# EAGLE design py32f030f18p6-led (EAGLE 9.6.1)

## Sheet 1 of 2
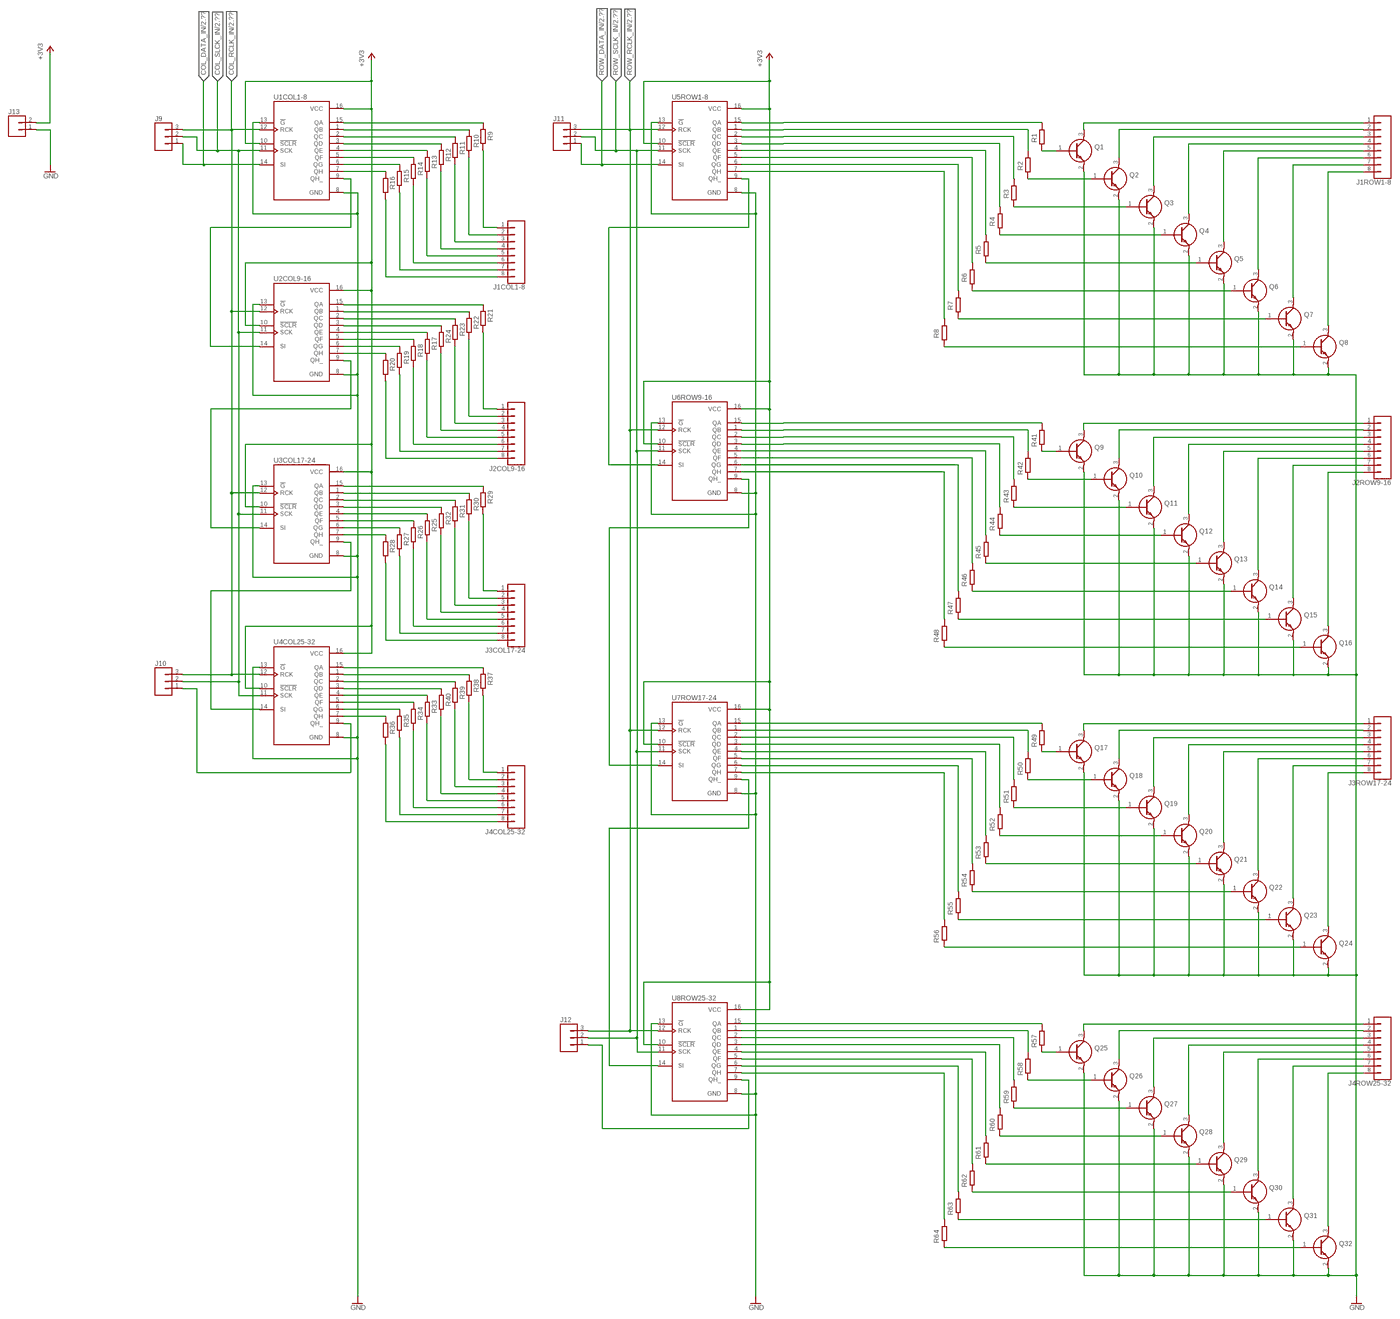
[diagram p0: schematic, sheet 1, overview]
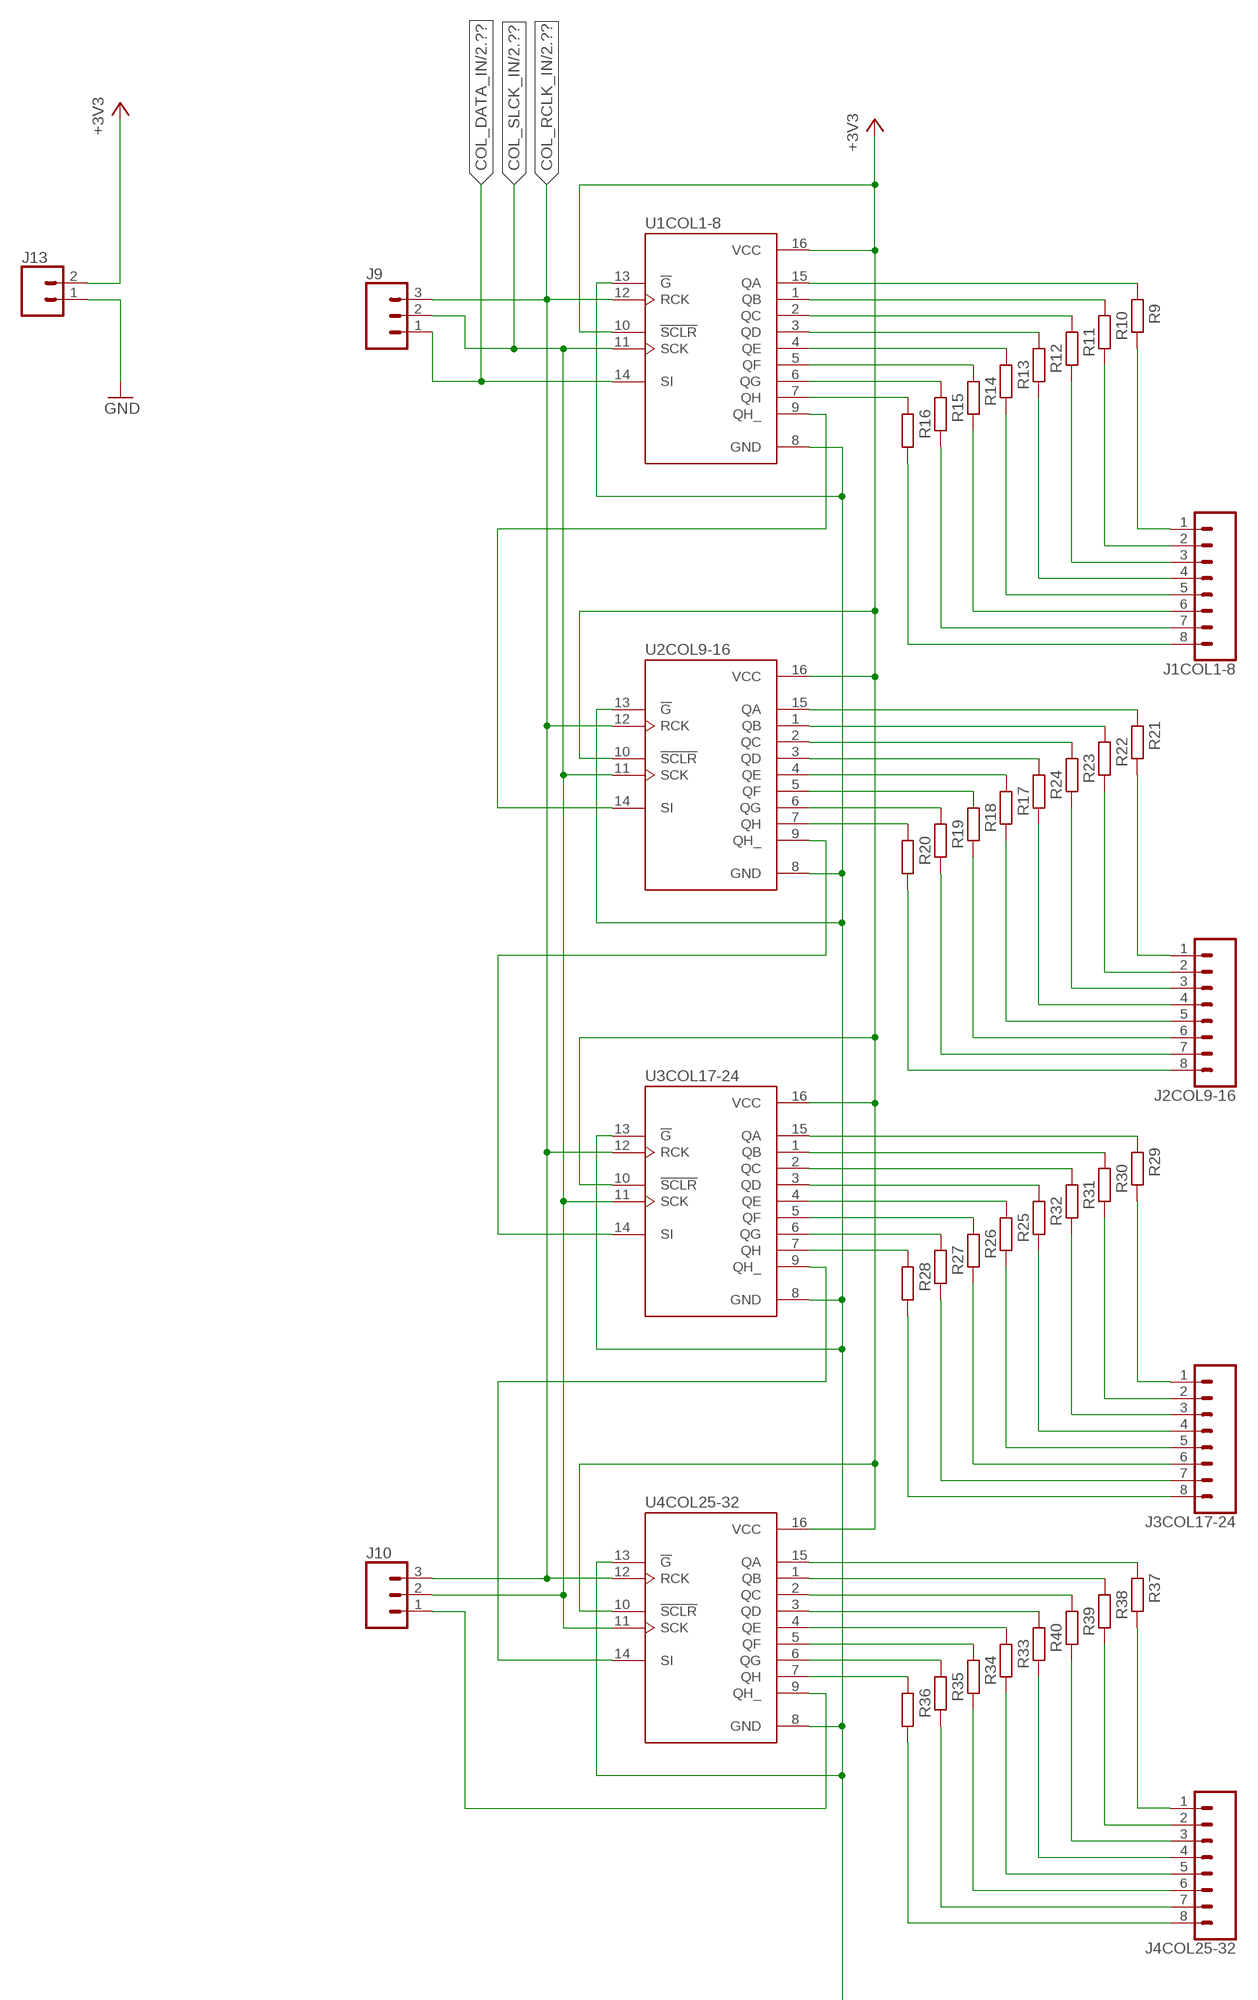
[diagram p1: schematic, sheet 1, part 1 of 4]
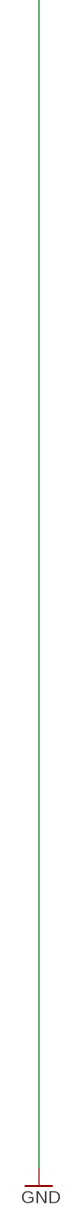
[diagram p2: schematic, sheet 1, part 2 of 4]
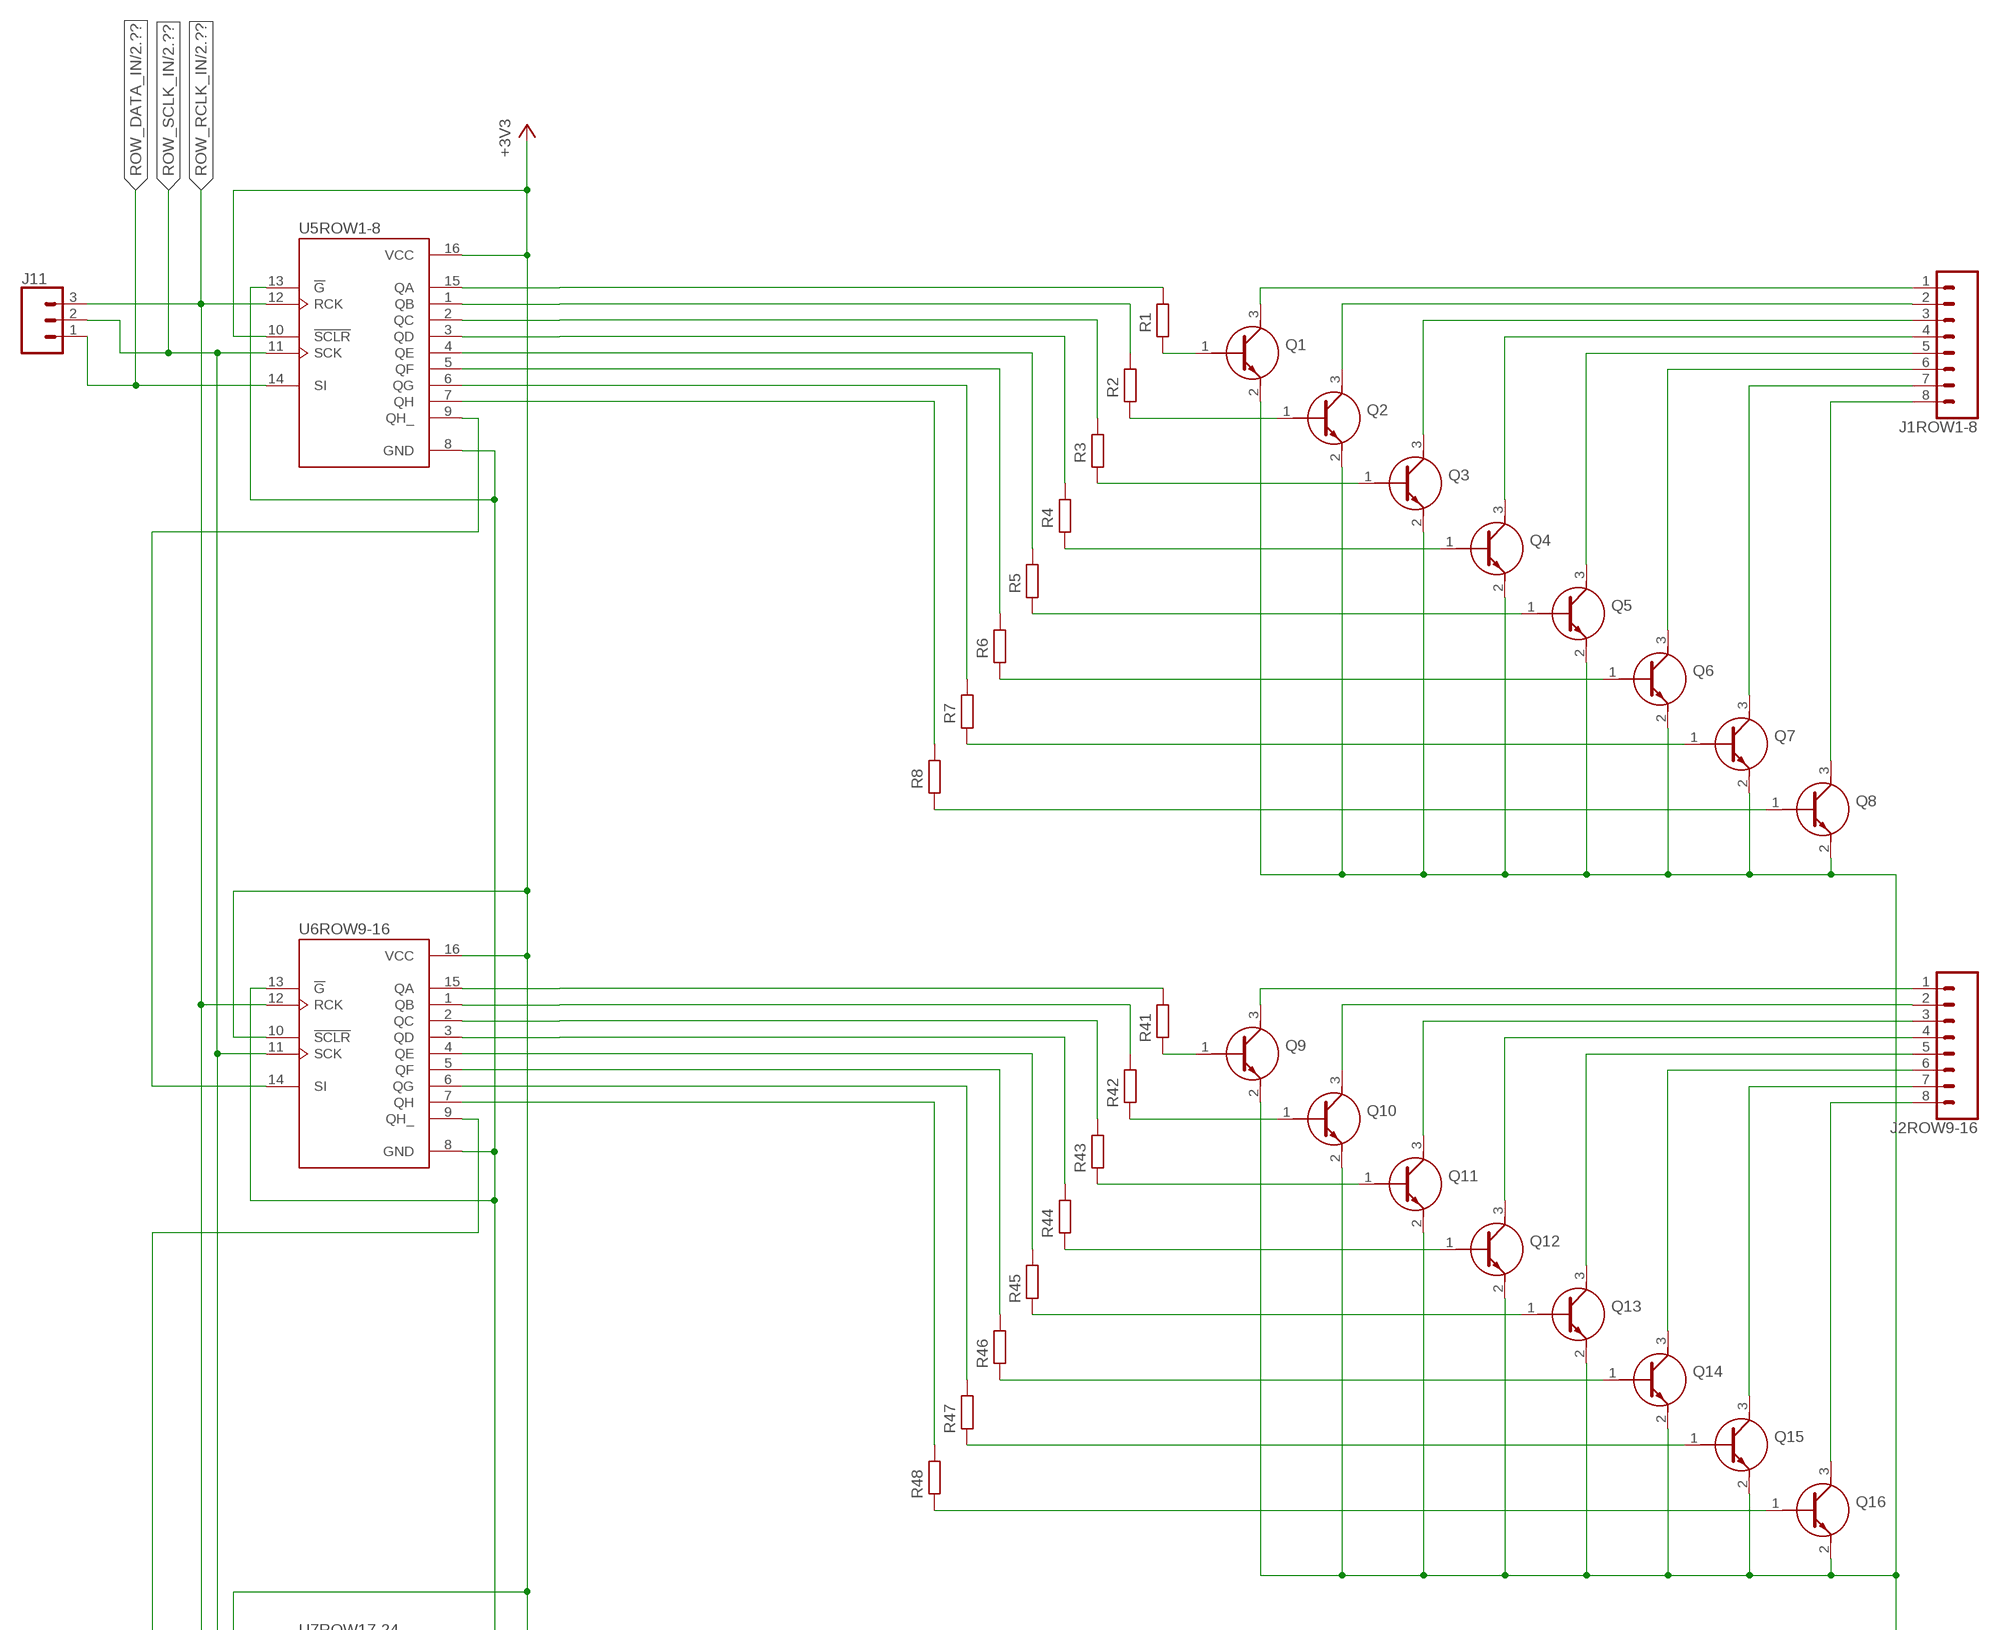
[diagram p3: schematic, sheet 1, part 3 of 4]
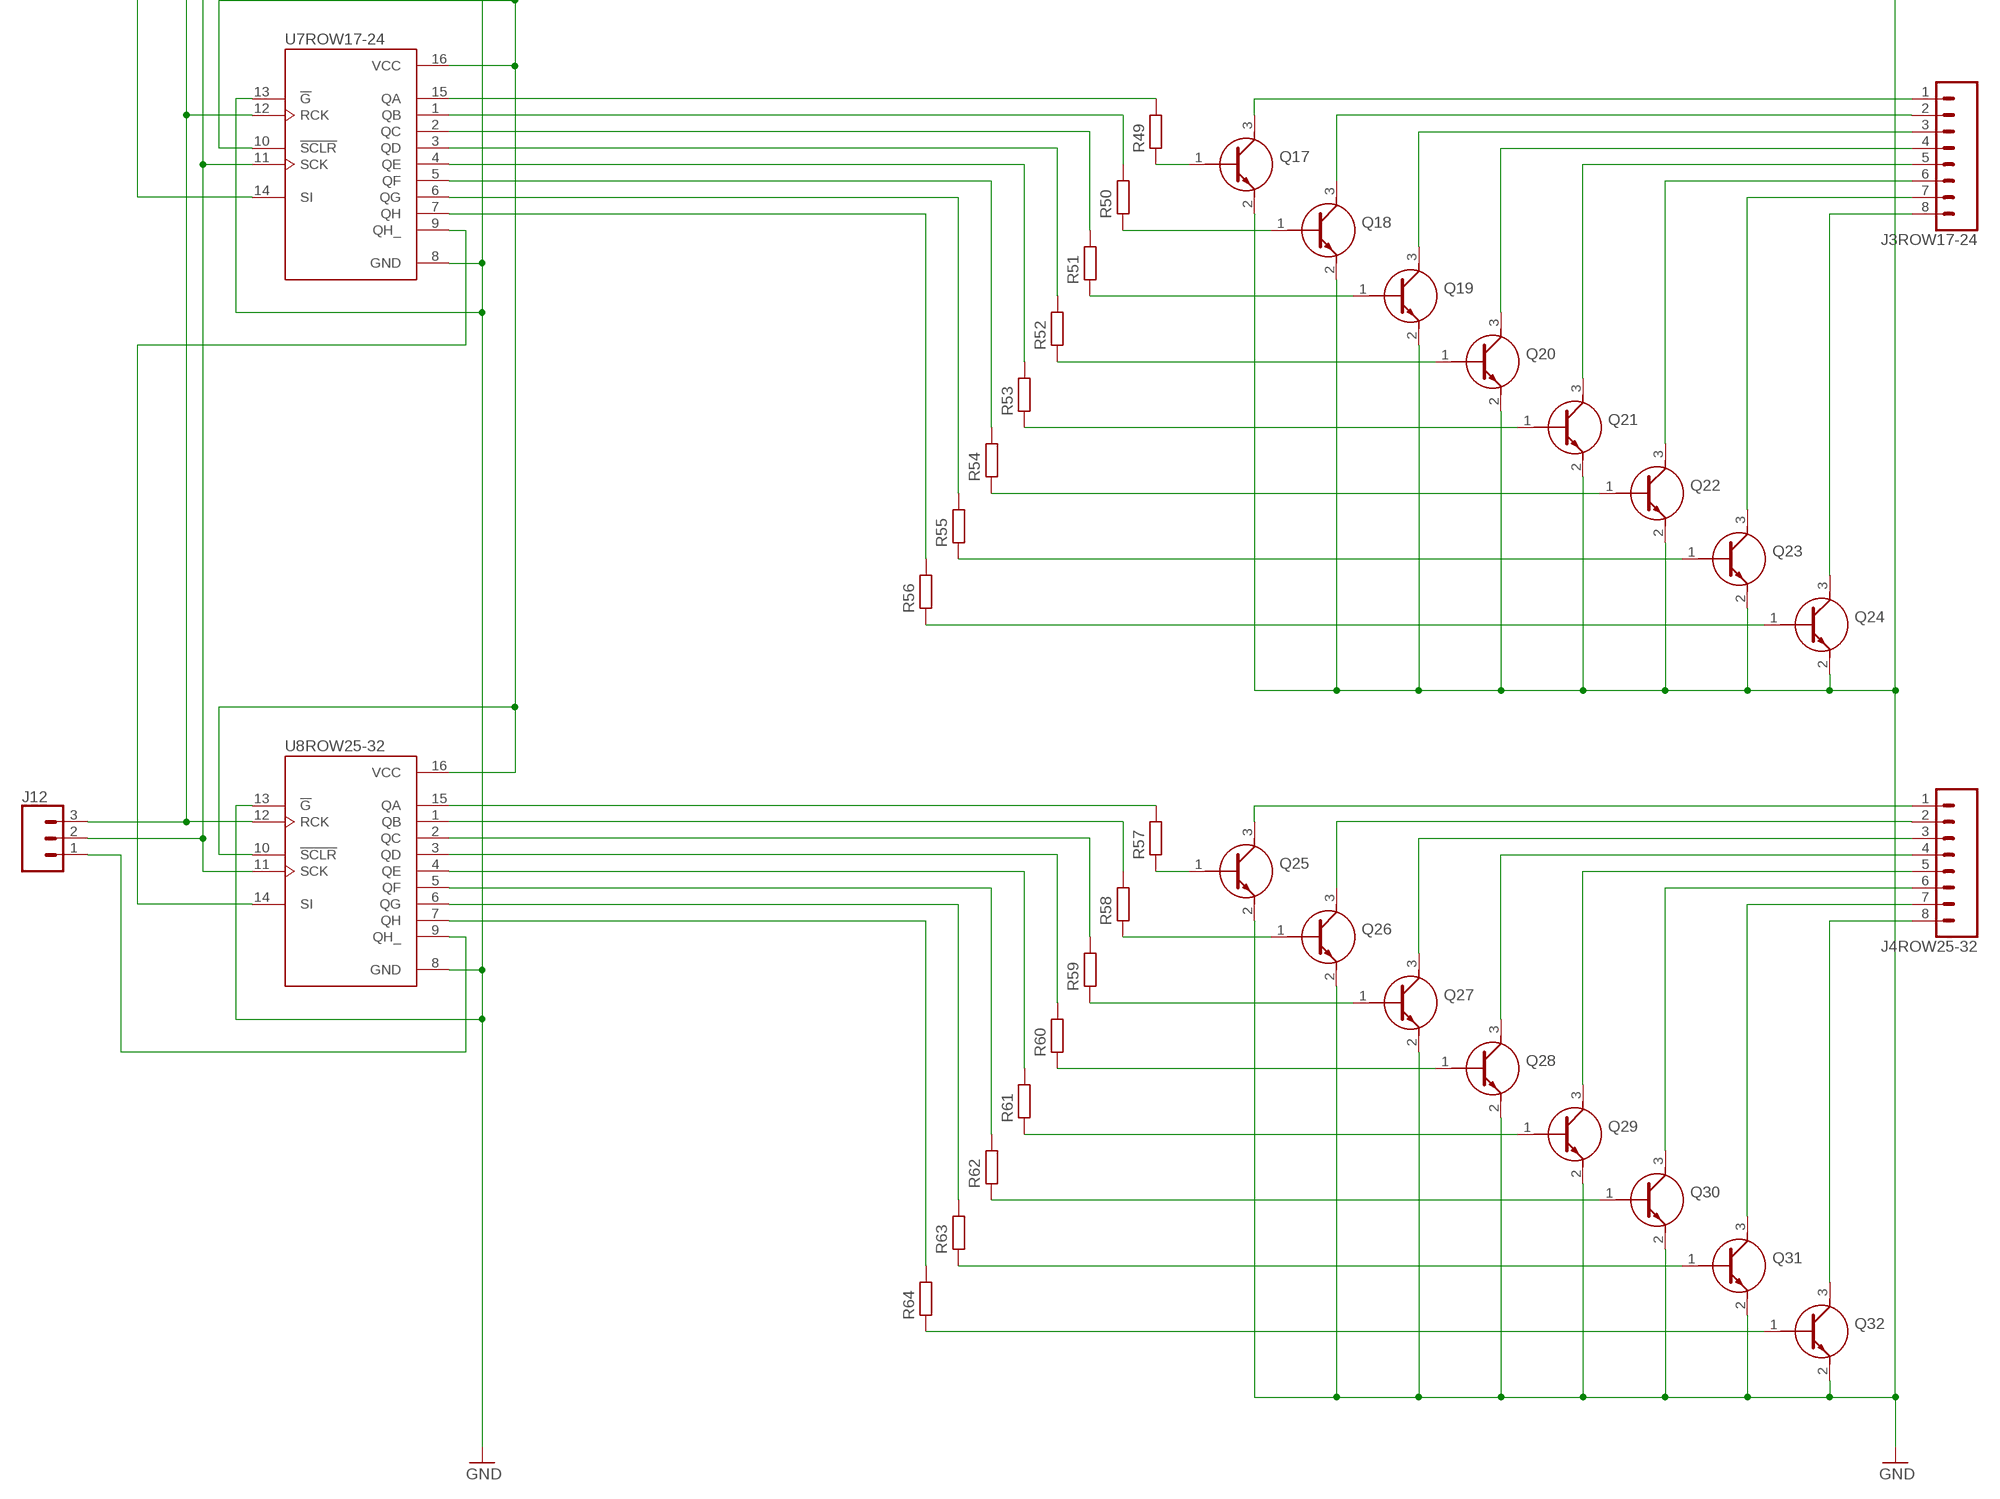
[diagram p4: schematic, sheet 1, part 4 of 4]

### Parts
J1COL1-8  CONN_08"  [1X08]
J1ROW1-8  CONN_08"  [1X08]
J2COL9-16  CONN_08"  [1X08]
J2ROW9-16  CONN_08"  [1X08]
J3COL17-24  CONN_08"  [1X08]
J3ROW17-24  CONN_08"  [1X08]
J4COL25-32  CONN_08"  [1X08]
J4ROW25-32  CONN_08"  [1X08]
J9  455-1750-1-ND  CONN_03  [1X03]
J10  455-1750-1-ND  CONN_03  [1X03]
J11  455-1750-1-ND  CONN_03  [1X03]
J12  455-1750-1-ND  CONN_03  [1X03]
J13  CONN_02  [1X02]
Q1  MMBT3904LT3G  [SOT96P237X111-3N]
Q2  MMBT3904LT3G  [SOT96P237X111-3N]
Q3  MMBT3904LT3G  [SOT96P237X111-3N]
Q4  MMBT3904LT3G  [SOT96P237X111-3N]
Q5  MMBT3904LT3G  [SOT96P237X111-3N]
Q6  MMBT3904LT3G  [SOT96P237X111-3N]
Q7  MMBT3904LT3G  [SOT96P237X111-3N]
Q8  MMBT3904LT3G  [SOT96P237X111-3N]
Q9  MMBT3904LT3G  [SOT96P237X111-3N]
Q10  MMBT3904LT3G  [SOT96P237X111-3N]
Q11  MMBT3904LT3G  [SOT96P237X111-3N]
Q12  MMBT3904LT3G  [SOT96P237X111-3N]
Q13  MMBT3904LT3G  [SOT96P237X111-3N]
Q14  MMBT3904LT3G  [SOT96P237X111-3N]
Q15  MMBT3904LT3G  [SOT96P237X111-3N]
Q16  MMBT3904LT3G  [SOT96P237X111-3N]
Q17  MMBT3904LT3G  [SOT96P237X111-3N]
Q18  MMBT3904LT3G  [SOT96P237X111-3N]
Q19  MMBT3904LT3G  [SOT96P237X111-3N]
Q20  MMBT3904LT3G  [SOT96P237X111-3N]
Q21  MMBT3904LT3G  [SOT96P237X111-3N]
Q22  MMBT3904LT3G  [SOT96P237X111-3N]
Q23  MMBT3904LT3G  [SOT96P237X111-3N]
Q24  MMBT3904LT3G  [SOT96P237X111-3N]
Q25  MMBT3904LT3G  [SOT96P237X111-3N]
Q26  MMBT3904LT3G  [SOT96P237X111-3N]
Q27  MMBT3904LT3G  [SOT96P237X111-3N]
Q28  MMBT3904LT3G  [SOT96P237X111-3N]
Q29  MMBT3904LT3G  [SOT96P237X111-3N]
Q30  MMBT3904LT3G  [SOT96P237X111-3N]
Q31  MMBT3904LT3G  [SOT96P237X111-3N]
Q32  MMBT3904LT3G  [SOT96P237X111-3N]
R1  10K  R-EU_R0805  [R0805]
R2  10K  R-EU_R0805  [R0805]
R3  10K  R-EU_R0805  [R0805]
R4  10K  R-EU_R0805  [R0805]
R5  10K  R-EU_R0805  [R0805]
R6  10K  R-EU_R0805  [R0805]
R7  10K  R-EU_R0805  [R0805]
R8  10K  R-EU_R0805  [R0805]
R9  10K  R-EU_R0805  [R0805]
R10  10K  R-EU_R0805  [R0805]
R11  10K  R-EU_R0805  [R0805]
R12  10K  R-EU_R0805  [R0805]
R13  10K  R-EU_R0805  [R0805]
R14  10K  R-EU_R0805  [R0805]
R15  10K  R-EU_R0805  [R0805]
R16  10K  R-EU_R0805  [R0805]
R17  10K  R-EU_R0805  [R0805]
R18  10K  R-EU_R0805  [R0805]
R19  10K  R-EU_R0805  [R0805]
R20  10K  R-EU_R0805  [R0805]
R21  10K  R-EU_R0805  [R0805]
R22  10K  R-EU_R0805  [R0805]
R23  10K  R-EU_R0805  [R0805]
R24  10K  R-EU_R0805  [R0805]
R25  10K  R-EU_R0805  [R0805]
R26  10K  R-EU_R0805  [R0805]
R27  10K  R-EU_R0805  [R0805]
R28  10K  R-EU_R0805  [R0805]
R29  10K  R-EU_R0805  [R0805]
R30  10K  R-EU_R0805  [R0805]
R31  10K  R-EU_R0805  [R0805]
R32  10K  R-EU_R0805  [R0805]
R33  10K  R-EU_R0805  [R0805]
R34  10K  R-EU_R0805  [R0805]
R35  10K  R-EU_R0805  [R0805]
R36  10K  R-EU_R0805  [R0805]
R37  10K  R-EU_R0805  [R0805]
R38  10K  R-EU_R0805  [R0805]
R39  10K  R-EU_R0805  [R0805]
R40  10K  R-EU_R0805  [R0805]
R41  10K  R-EU_R0805  [R0805]
R42  10K  R-EU_R0805  [R0805]
R43  10K  R-EU_R0805  [R0805]
R44  10K  R-EU_R0805  [R0805]
R45  10K  R-EU_R0805  [R0805]
R46  10K  R-EU_R0805  [R0805]
R47  10K  R-EU_R0805  [R0805]
R48  10K  R-EU_R0805  [R0805]
R49  10K  R-EU_R0805  [R0805]
R50  10K  R-EU_R0805  [R0805]
R51  10K  R-EU_R0805  [R0805]
R52  10K  R-EU_R0805  [R0805]
R53  10K  R-EU_R0805  [R0805]
R54  10K  R-EU_R0805  [R0805]
R55  10K  R-EU_R0805  [R0805]
R56  10K  R-EU_R0805  [R0805]
R57  10K  R-EU_R0805  [R0805]
R58  10K  R-EU_R0805  [R0805]
R59  10K  R-EU_R0805  [R0805]
R60  10K  R-EU_R0805  [R0805]
R61  10K  R-EU_R0805  [R0805]
R62  10K  R-EU_R0805  [R0805]
R63  10K  R-EU_R0805  [R0805]
R64  10K  R-EU_R0805  [R0805]
U1COL1-8  TC74HC595AF(EL,F)  [SOIC127P780X190-16N]
U2COL9-16  TC74HC595AF(EL,F)  [SOIC127P780X190-16N]
U3COL17-24  TC74HC595AF(EL,F)  [SOIC127P780X190-16N]
U4COL25-32  TC74HC595AF(EL,F)  [SOIC127P780X190-16N]
U5ROW1-8  TC74HC595AF(EL,F)  [SOIC127P780X190-16N]
U6ROW9-16  TC74HC595AF(EL,F)  [SOIC127P780X190-16N]
U7ROW17-24  TC74HC595AF(EL,F)  [SOIC127P780X190-16N]
U8ROW25-32  TC74HC595AF(EL,F)  [SOIC127P780X190-16N]

### Nets
+3V3 [supply]: J13.2 U1COL1-8.10(!SCLR) U1COL1-8.16(VCC) U2COL9-16.10(!SCLR) U2COL9-16.16(VCC) U3COL17-24.10(!SCLR) U3COL17-24.16(VCC) U4COL25-32.10(!SCLR) U4COL25-32.16(VCC) U5ROW1-8.10(!SCLR) U5ROW1-8.16(VCC) U6ROW9-16.10(!SCLR) U6ROW9-16.16(VCC) U7ROW17-24.10(!SCLR) U7ROW17-24.16(VCC) U8ROW25-32.10(!SCLR) U8ROW25-32.16(VCC) ; also sheet 2
COL_DATA_IN: J9.1 U1COL1-8.14(SI) ; also sheet 2
COL_RCLK_IN: J9.3 J10.3 U1COL1-8.12(RCK) U2COL9-16.12(RCK) U3COL17-24.12(RCK) U4COL25-32.12(RCK) ; also sheet 2
COL_SLCK_IN: J9.2 J10.2 U1COL1-8.11(SCK) U2COL9-16.11(SCK) U3COL17-24.11(SCK) U4COL25-32.11(SCK) ; also sheet 2
GND [supply]: J13.1 Q1.2(E) Q2.2(E) Q3.2(E) Q4.2(E) Q5.2(E) Q6.2(E) Q7.2(E) Q8.2(E) Q9.2(E) Q10.2(E) Q11.2(E) Q12.2(E) Q13.2(E) Q14.2(E) Q15.2(E) Q16.2(E) Q17.2(E) Q18.2(E) Q19.2(E) Q20.2(E) Q21.2(E) Q22.2(E) Q23.2(E) Q24.2(E) Q25.2(E) Q26.2(E) Q27.2(E) Q28.2(E) Q29.2(E) Q30.2(E) Q31.2(E) Q32.2(E) U1COL1-8.8(GND) U1COL1-8.13(!G) U2COL9-16.8(GND) U2COL9-16.13(!G) U3COL17-24.8(GND) U3COL17-24.13(!G) U4COL25-32.8(GND) U4COL25-32.13(!G) U5ROW1-8.8(GND) U5ROW1-8.13(!G) U6ROW9-16.8(GND) U6ROW9-16.13(!G) U7ROW17-24.8(GND) U7ROW17-24.13(!G) U8ROW25-32.8(GND) U8ROW25-32.13(!G) ; also sheet 2
N$1: J1ROW1-8.1 Q1.3(C)
N$2: J1ROW1-8.2 Q2.3(C)
N$3: J1ROW1-8.3 Q3.3(C)
N$4: J1ROW1-8.4 Q4.3(C)
N$5: J1ROW1-8.5 Q5.3(C)
N$6: J1ROW1-8.6 Q6.3(C)
N$7: J1ROW1-8.7 Q7.3(C)
N$8: J1ROW1-8.8 Q8.3(C)
N$9: R13.2 U1COL1-8.4(QE)
N$10: Q1.1(B) R1.2
N$11: Q2.1(B) R2.2
N$12: Q3.1(B) R3.2
N$13: Q4.1(B) R4.2
N$14: Q5.1(B) R5.2
N$15: Q6.1(B) R6.2
N$16: Q7.1(B) R7.2
N$17: Q8.1(B) R8.2
N$18: R12.2 U1COL1-8.3(QD)
N$19: R11.2 U1COL1-8.2(QC)
N$20: R14.2 U1COL1-8.5(QF)
N$21: R16.2 U1COL1-8.7(QH)
N$22: R15.2 U1COL1-8.6(QG)
N$23: R10.2 U1COL1-8.1(QB)
N$24: R9.2 U1COL1-8.15(QA)
N$25: J1COL1-8.3 R11.1
N$26: J1COL1-8.4 R12.1
N$27: J1COL1-8.5 R13.1
N$28: J1COL1-8.6 R14.1
N$29: J1COL1-8.7 R15.1
N$30: J1COL1-8.8 R16.1
N$42: Q9.1(B) R41.2
N$43: R20.2 U2COL9-16.7(QH)
N$44: R19.2 U2COL9-16.6(QG)
N$45: J1COL1-8.2 R10.1
N$46: R18.2 U2COL9-16.5(QF)
N$47: R17.2 U2COL9-16.4(QE)
N$48: J1COL1-8.1 R9.1
N$49: R24.2 U2COL9-16.3(QD)
N$50: R23.2 U2COL9-16.2(QC)
N$51: R22.2 U2COL9-16.1(QB)
N$52: R21.2 U2COL9-16.15(QA)
N$53: J2COL9-16.2 R22.1
N$54: J2COL9-16.1 R21.1
N$55: J2COL9-16.3 R23.1
N$56: J2COL9-16.4 R24.1
N$57: Q10.1(B) R42.2
N$58: J2COL9-16.5 R17.1
N$59: J2COL9-16.6 R18.1
N$60: J2COL9-16.7 R19.1
N$61: J2COL9-16.8 R20.1
N$62: U2COL9-16.9(QH_) U3COL17-24.14(SI)
N$63: U1COL1-8.9(QH_) U2COL9-16.14(SI)
N$64: Q11.1(B) R43.2
N$65: Q12.1(B) R44.2
N$66: Q13.1(B) R45.2
N$67: R28.2 U3COL17-24.7(QH)
N$68: R27.2 U3COL17-24.6(QG)
N$69: R26.2 U3COL17-24.5(QF)
N$70: R25.2 U3COL17-24.4(QE)
N$71: R32.2 U3COL17-24.3(QD)
N$72: R31.2 U3COL17-24.2(QC)
N$73: R30.2 U3COL17-24.1(QB)
N$74: R29.2 U3COL17-24.15(QA)
N$75: J3COL17-24.2 R30.1
N$76: J3COL17-24.1 R29.1
N$77: J3COL17-24.3 R31.1
N$78: J3COL17-24.4 R32.1
N$79: J3COL17-24.5 R25.1
N$80: J3COL17-24.6 R26.1
N$81: J3COL17-24.7 R27.1
N$82: J3COL17-24.8 R28.1
N$83: U3COL17-24.9(QH_) U4COL25-32.14(SI)
N$84: Q14.1(B) R46.2
N$85: Q15.1(B) R47.2
N$86: Q16.1(B) R48.2
N$88: R36.2 U4COL25-32.7(QH)
N$89: R35.2 U4COL25-32.6(QG)
N$90: R34.2 U4COL25-32.5(QF)
N$91: R33.2 U4COL25-32.4(QE)
N$92: R40.2 U4COL25-32.3(QD)
N$93: R39.2 U4COL25-32.2(QC)
N$94: R38.2 U4COL25-32.1(QB)
N$95: R37.2 U4COL25-32.15(QA)
N$96: J4COL25-32.2 R38.1
N$97: J4COL25-32.1 R37.1
N$98: J4COL25-32.3 R39.1
N$99: J4COL25-32.4 R40.1
N$100: J4COL25-32.5 R33.1
N$101: J4COL25-32.6 R34.1
N$102: J4COL25-32.7 R35.1
N$103: J4COL25-32.8 R36.1
N$104: J10.1 U4COL25-32.9(QH_)
N$111: J2ROW9-16.1 Q9.3(C)
N$112: J2ROW9-16.2 Q10.3(C)
N$113: J2ROW9-16.3 Q11.3(C)
N$114: J2ROW9-16.4 Q12.3(C)
N$115: J2ROW9-16.5 Q13.3(C)
N$116: J2ROW9-16.6 Q14.3(C)
N$117: J2ROW9-16.7 Q15.3(C)
N$118: J2ROW9-16.8 Q16.3(C)
N$120: Q17.1(B) R49.2
N$121: Q18.1(B) R50.2
N$122: Q19.1(B) R51.2
N$123: Q20.1(B) R52.2
N$124: Q21.1(B) R53.2
N$125: Q22.1(B) R54.2
N$126: Q23.1(B) R55.2
N$127: Q24.1(B) R56.2
N$135: J3ROW17-24.1 Q17.3(C)
N$136: J3ROW17-24.2 Q18.3(C)
N$137: J3ROW17-24.3 Q19.3(C)
N$138: J3ROW17-24.4 Q20.3(C)
N$139: J3ROW17-24.5 Q21.3(C)
N$140: J3ROW17-24.6 Q22.3(C)
N$141: J3ROW17-24.7 Q23.3(C)
N$142: J3ROW17-24.8 Q24.3(C)
N$144: Q25.1(B) R57.2
N$145: Q26.1(B) R58.2
N$146: Q27.1(B) R59.2
N$147: Q28.1(B) R60.2
N$148: Q29.1(B) R61.2
N$149: Q30.1(B) R62.2
N$150: Q31.1(B) R63.2
N$151: Q32.1(B) R64.2
N$159: J4ROW25-32.1 Q25.3(C)
N$160: J4ROW25-32.2 Q26.3(C)
N$161: J4ROW25-32.3 Q27.3(C)
N$162: J4ROW25-32.4 Q28.3(C)
N$163: J4ROW25-32.5 Q29.3(C)
N$164: J4ROW25-32.6 Q30.3(C)
N$165: J4ROW25-32.7 Q31.3(C)
N$166: J4ROW25-32.8 Q32.3(C)
N$168: R8.1 U5ROW1-8.7(QH)
N$169: R7.1 U5ROW1-8.6(QG)
N$170: R6.1 U5ROW1-8.5(QF)
N$171: R5.1 U5ROW1-8.4(QE)
N$172: R4.1 U5ROW1-8.3(QD)
N$173: R3.1 U5ROW1-8.2(QC)
N$174: R2.1 U5ROW1-8.1(QB)
N$175: R1.1 U5ROW1-8.15(QA)
N$179: R48.1 U6ROW9-16.7(QH)
N$180: R47.1 U6ROW9-16.6(QG)
N$181: R46.1 U6ROW9-16.5(QF)
N$182: R45.1 U6ROW9-16.4(QE)
N$183: R44.1 U6ROW9-16.3(QD)
N$184: R43.1 U6ROW9-16.2(QC)
N$185: R42.1 U6ROW9-16.1(QB)
N$186: R41.1 U6ROW9-16.15(QA)
N$187: U6ROW9-16.9(QH_) U7ROW17-24.14(SI)
N$188: U5ROW1-8.9(QH_) U6ROW9-16.14(SI)
N$189: R56.1 U7ROW17-24.7(QH)
N$190: R55.1 U7ROW17-24.6(QG)
N$191: R54.1 U7ROW17-24.5(QF)
N$192: R53.1 U7ROW17-24.4(QE)
N$193: R52.1 U7ROW17-24.3(QD)
N$194: R51.1 U7ROW17-24.2(QC)
N$195: R50.1 U7ROW17-24.1(QB)
N$196: R49.1 U7ROW17-24.15(QA)
N$197: U7ROW17-24.9(QH_) U8ROW25-32.14(SI)
N$198: R64.1 U8ROW25-32.7(QH)
N$199: R63.1 U8ROW25-32.6(QG)
N$200: R62.1 U8ROW25-32.5(QF)
N$201: R61.1 U8ROW25-32.4(QE)
N$202: R60.1 U8ROW25-32.3(QD)
N$203: R59.1 U8ROW25-32.2(QC)
N$204: R58.1 U8ROW25-32.1(QB)
N$205: R57.1 U8ROW25-32.15(QA)
N$206: J12.1 U8ROW25-32.9(QH_)
ROW_DATA_IN: J11.1 U5ROW1-8.14(SI) ; also sheet 2
ROW_RCLK_IN: J11.3 J12.3 U5ROW1-8.12(RCK) U6ROW9-16.12(RCK) U7ROW17-24.12(RCK) U8ROW25-32.12(RCK) ; also sheet 2
ROW_SCLK_IN: J11.2 J12.2 U5ROW1-8.11(SCK) U6ROW9-16.11(SCK) U7ROW17-24.11(SCK) U8ROW25-32.11(SCK) ; also sheet 2

## Sheet 2 of 2
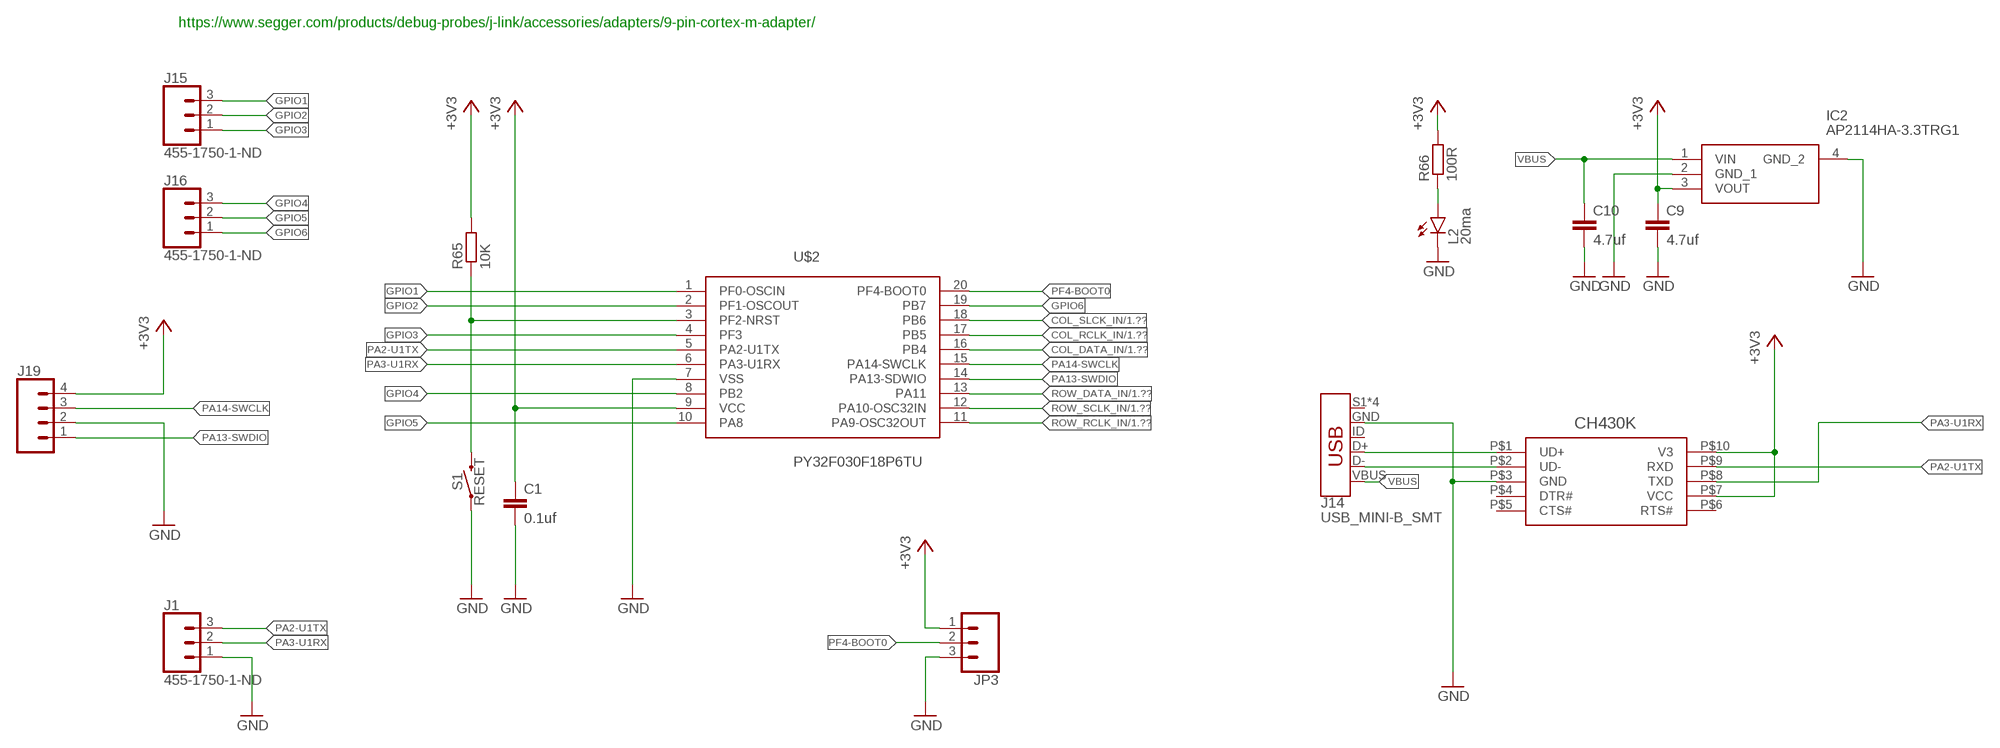
[diagram p5: schematic, sheet 2]

### Parts
C1  0.1uf  C-EUC0805  [C0805]
C9  4.7uf  C-EUC1206  [C1206]
C10  4.7uf  C-EUC1206  [C1206]
IC2  AP2114HA-3.3TRG1  [SOT230P700X180-4N]
J1  455-1750-1-ND  CONN_03  [1X03]
J14  USB_MINI-B_SMT  [USB-MINIB]
J15  455-1750-1-ND  CONN_03  [1X03]
J16  455-1750-1-ND  CONN_03  [1X03]
J19  CONN_04PTH  [1X04]
JP3  455-1750-1-ND  CONN_03  [1X03]
L2  20ma  LEDSML0805  [SML0805]
R65  10K  R-EU_R0805  [R0805]
R66  100R  R-EU_R0805  [R0805]
S1  RESET  MOMENTARY-SWITCH-SPST-SMD-6.0X3.5MM  [TACTILE_SWITCH_SMD_6.0X3.5MM]
U$1  CH430K  [ESSOP-10]
U$2  PY32F030F18P6TU  [TSSOP20]

### Nets
+3V3 [supply]: C1.1 C9.1 IC2.3(VOUT) J19.4 JP3.1 R65.2 R66.2 U$1.P$7(VCC) U$1.P$10(V3) U$2.9(VCC) ; also sheet 1
COL_DATA_IN: U$2.16(PB4) ; also sheet 1
COL_RCLK_IN: U$2.17(PB5) ; also sheet 1
COL_SLCK_IN: U$2.18(PB6) ; also sheet 1
GND [supply]: C1.2 C9.2 C10.2 IC2.2(GND_1) IC2.4(GND_2) J1.1 J14.GND J19.2 JP3.3 L2.C S1.1 U$1.P$3(GND) U$2.7(VSS) ; also sheet 1
GPIO1: J15.3 U$2.1(PF0-OSCIN)
GPIO2: J15.2 U$2.2(PF1-OSCOUT)
GPIO3: J15.1 U$2.4(PF3)
GPIO4: J16.3 U$2.8(PB2)
GPIO5: J16.2 U$2.10(PA8)
GPIO6: J16.1 U$2.19(PB7)
N$33 [supply]: L2.A R66.1
PA2-U1TX: J1.3 U$1.P$9(RXD) U$2.5(PA2-U1TX)
PA3-U1RX: J1.2 U$1.P$8(TXD) U$2.6(PA3-U1RX)
PA13-SWDIO: J19.1 U$2.14(PA13-SDWIO)
PA14-SWCLK: J19.3 U$2.15(PA14-SWCLK)
PF2-NRST: R65.1 S1.2 U$2.3(PF2-NRST)
PF4-BOOT0: JP3.2 U$2.20(PF4-BOOT0)
ROW_DATA_IN: U$2.13(PA11) ; also sheet 1
ROW_RCLK_IN: U$2.11(PA9-OSC32OUT) ; also sheet 1
ROW_SCLK_IN: U$2.12(PA10-OSC32IN) ; also sheet 1
USB_N: J14.D- U$1.P$2(UD-)
USB_P: J14.D+ U$1.P$1(UD+)
VBUS: C10.1 IC2.1(VIN) J14.VBUS
Unconnected: J14.ID J14.S1(SHIELD) J14.S2(SHIELD) J14.S3(SHIELD) J14.S4(SHIELD) U$1.P$4(DTR#) U$1.P$5(CTS#) U$1.P$6(RTS#)

### Notes on the sheet
- https://www.segger.com/products/debug-probes/j-link/accessories/adapters/9-pin-cortex-m-adapter/

## Library data of the parts
C1 C9 C10 = rcl:C-EU: CAPACITOR, European symbol; SPICEPREFIX: C
IC2 = AP2114HA-3.3TRG1:AP2114HA-3.3TRG1: Linear Voltage Regulator IC Positive Fixed 1 Output 1A SOT-223-3 Source: Datasheet <https://www.diodes.com//assets/Datasheets/AP2114.pdf>; ARROW_PART_NUMBER: AP2114HA-3.3TRG1; ARROW_PRICE-STOCK: https://www.arrow.com/en/products/ap2114ha-3.3trg1/diodes-incorporated?region=asia; DESCRIPTION: Linear Voltage Regulator IC Positive Fixed 1 Output 1A SOT-223-3; HEIGHT: 1.8mm; MANUFACTURER_NAME: Diodes Incorporated; MANUFACTURER_PART_NUMBER: AP2114HA-3.3TRG1; MOUSER_PART_NUMBER: 621-AP2114HA-3.3TRG1; MOUSER_PRICE-STOCK: https://www.mouser.co.uk/ProductDetail/Diodes-Incorporated/AP2114HA-3.3TRG1?qs=M%2FOdCRO8QQ3KWhA9Gt6VoQ%3D%3D
J1 J9-J12 J15 J16 JP3 = SparkFun-Connectors:CONN_03: Multi connection point. Often used as Generic Header-pin footprint for 0.1 inch spaced/style header connections On any of the 0.1 inch spaced packages, you can populate with these: Break Away Headers - Straight <https://www.sparkfun.com/products/116> (PRT-00116) Break Away Male Headers - Right Angle <https://www.sparkfun.com/products/553> (PRT-00553) Female Headers <https://www.sparkfun.com/products/115> (PRT-00115) Break Away Headers - Machine Pin <https://www.sparkfun.com/products/117> (PRT-00117) Break Away Female Headers - Swiss Machine Pin <https://www.sparkfun.com/products/743> (PRT-00743) Stackable Header - 3 Pin (Female, 0.1") <https://www.sparkfun.com/products/13875> (PRT-13875) For SCREWTERMINALS and SPRING TERMINALS visit here: Screw Terimnals on SparkFun.com <https://www.sparkfun.com/search/results?term=Screw+Terminals> (5mm/3.5mm/2.54mm spacing) This device is also useful as a general connection point to wire up your design to another part of your project. Our various solder wires solder well into these plated through hole pads. Hook-Up Wire - Assortment (Stranded, 22 AWG) <https://www.sparkfun.com/products/11375> (PRT-11375) Hook-Up Wire - Assortment (Solid Core, 22 AWG) <https://www.sparkfun.com/products/11367> (PRT-11367) View the entire wire category on our website here <https://www.sparkfun.com/categories/141> Special notes: Molex polarized connector foot print use with SKU : PRT-08232 with associated crimp pins and housings.; PROD_ID: XXX-00000
J1COL1-8 J1ROW1-8 J2COL9-16 J2ROW9-16 J3COL17-24 J3ROW17-24 J4COL25-32 J4ROW25-32 = SparkFun-Connectors:CONN_08: Multi connection point. Often used as Generic Header-pin footprint for 0.1 inch spaced/style header connections On any of the 0.1 inch spaced packages, you can populate with these: Break Away Headers - Straight <https://www.sparkfun.com/products/116> (PRT-00116) Break Away Male Headers - Right Angle <https://www.sparkfun.com/products/553> (PRT-00553) Female Headers <https://www.sparkfun.com/products/115> (PRT-00115) Break Away Headers - Machine Pin <https://www.sparkfun.com/products/117> (PRT-00117) Break Away Female Headers - Swiss Machine Pin <https://www.sparkfun.com/products/743> (PRT-00743) Arduino Stackable Header - 8 Pin <https://www.sparkfun.com/products/9279> (PRT-09279) For SCREWTERMINALS and SPRING TERMINALS visit here: Screw Terimnals on SparkFun.com <https://www.sparkfun.com/search/results?term=Screw+Terminals> (5mm/3.5mm/2.54mm spacing) This device is also useful as a general connection point to wire up your design to another part of your project. Our various solder wires solder well into these plated through hole pads. Hook-Up Wire - Assortment (Stranded, 22 AWG) <https://www.sparkfun.com/products/11375> (PRT-11375) Hook-Up Wire - Assortment (Solid Core, 22 AWG) <https://www.sparkfun.com/products/11367> (PRT-11367) View the entire wire category on our website here <https://www.sparkfun.com/categories/141> Special notes: Molex polarized connector foot print use with SKU : PRT-08231 with associated crimp pins and housings. 1MM SMD Version SKU: PRT-10208 NOTES ON THE VARIANTS LOCK and LOCK_LONGPADS... This footprint was designed to help hold the alignment of a through-hole component (i.e. 6-pin header) while soldering it into place. You may notice that each hole has been shifted either up or down by 0.005 of an inch from it's more standard position (which is a perfectly straight line). This slight alteration caused the pins (the squares in the middle) to touch the edges of the holes. Because they are alternating, it causes a "brace" to hold the component in place. 0.005 has proven to be the perfect amount of "off-center" position when using our standard breakaway headers. Although looks a little odd when you look at the bare footprint, once you have a header in there, the alteration is very hard to notice. Also,if you push a header all the way into place, it is covered up entirely on the bottom side.; PROD_ID: CONN-08438
J13 = SparkFun-Connectors:CONN_02: Multi connection point. Often used as Generic Header-pin footprint for 0.1 inch spaced/style header connections On any of the 0.1 inch spaced packages, you can populate with these: Break Away Headers - Straight <https://www.sparkfun.com/products/116> (PRT-00116) Break Away Male Headers - Right Angle <https://www.sparkfun.com/products/553> (PRT-00553) Female Headers <https://www.sparkfun.com/products/115> (PRT-00115) Break Away Headers - Machine Pin <https://www.sparkfun.com/products/117> (PRT-00117) Break Away Female Headers - Swiss Machine Pin <https://www.sparkfun.com/products/743> (PRT-00743) For SCREWTERMINALS and SPRING TERMINALS visit here: Screw Terimnals on SparkFun.com <https://www.sparkfun.com/search/results?term=Screw+Terminals> (5mm/3.5mm/2.54mm spacing) This device is also useful as a general connection point to wire up your design to another part of your project. Our various solder wires solder well into these plated through hole pads. Hook-Up Wire - Assortment (Stranded, 22 AWG) <https://www.sparkfun.com/products/11375> (PRT-11375) Hook-Up Wire - Assortment (Solid Core, 22 AWG) <https://www.sparkfun.com/products/11367> (PRT-11367) View the entire wire category on our website here <https://www.sparkfun.com/categories/141> Special notes: Molex polarized connector foot print use with: PRT-08233 with associated crimp pins and housings. 2.54_SCREWTERM for use with PRT-10571. 3.5mm Screw Terminal footprints for PRT-08084 5mm Screw Terminal footprints for use with PRT-08432
J14 = SparkFun-Connectors:USB_MINI-B: USB type Mini-B Connector Breaks out 5th pin, and includes shield pins if needed. SparkFun Products: SparkFun FTDI Basic Breakout <https://www.sparkfun.com/products/9716> SparkFun XBee Explorer USB <https://www.sparkfun.com/products/11812> SparkFun Redboard <https://www.sparkfun.com/products/12757>; PROD_ID: CONN-08193; SF_ID: PRT-00587
J19 = SparkFun-Connectors:CONN_04: Multi connection point. Often used as Generic Header-pin footprint for 0.1 inch spaced/style header connections On any of the 0.1 inch spaced packages, you can populate with these: Break Away Headers - Straight <https://www.sparkfun.com/products/116> (PRT-00116) Break Away Male Headers - Right Angle <https://www.sparkfun.com/products/553> (PRT-00553) Female Headers <https://www.sparkfun.com/products/115> (PRT-00115) Break Away Headers - Machine Pin <https://www.sparkfun.com/products/117> (PRT-00117) Break Away Female Headers - Swiss Machine Pin <https://www.sparkfun.com/products/743> (PRT-00743) For SCREWTERMINALS and SPRING TERMINALS visit here: Screw Terimnals on SparkFun.com <https://www.sparkfun.com/search/results?term=Screw+Terminals> (5mm/3.5mm/2.54mm spacing) This device is also useful as a general connection point to wire up your design to another part of your project. Our various solder wires solder well into these plated through hole pads. Hook-Up Wire - Assortment (Stranded, 22 AWG) <https://www.sparkfun.com/products/11375> (PRT-11375) Hook-Up Wire - Assortment (Solid Core, 22 AWG) <https://www.sparkfun.com/products/11367> (PRT-11367) View the entire wire category on our website here <https://www.sparkfun.com/categories/141> Special notes: Molex polarized connector foot print use with SKU : PRT-08231 with associated crimp pins and housings. 1MM SMD Version SKU: PRT-10208; PROD_ID: CONN-09696
L2 = led:LED: LED OSRAM: - CHIPLED LG R971, LG N971, LY N971, LG Q971, LY Q971, LO R971, LY R971 LH N974, LH R974 LS Q976, LO Q976, LY Q976 LO Q996 - Hyper CHIPLED LW Q18S LB Q993, LB Q99A, LB R99A - SideLED LS A670, LO A670, LY A670, LG A670, LP A670 LB A673, LV A673, LT A673, LW A673 LH A674 LY A675 LS A676, LA A676, LO A676, LY A676, LW A676 LS A679, LY A679, LG A679 - Hyper Micro SIDELED® LS Y876, LA Y876, LO Y876, LY Y876 LT Y87S - SmartLED LW L88C, LW L88S LB L89C, LB L89S, LG L890 LS L89K, LO L89K, LY L89K LS L896, LA L896, LO L896, LY L896 - TOPLED LS T670, LO T670, LY T670, LG T670, LP T670 LSG T670, LSP T670, LSY T670, LOP T670, LYG T670 LG T671, LOG T671, LSG T671 LB T673, LV T673, LT T673, LW T673 LH T674 LS T676, LA T676, LO T676, LY T676, LB T676, LH T676, LSB T676, LW T676 LB T67C, LV T67C, LT T67C, LS T67K, LO T67K, LY T67K, LW E67C LS E67B, LA E67B, LO E67B, LY E67B, LB E67C, LV E67C, LT E67C LW T67C LS T679, LY T679, LG T679 LS T770, LO T770, LY T770, LG T770, LP T770 LB T773, LV T773, LT T773, LW T773 LH T774 LS E675, LA E675, LY E675, LS T675 LS T776, LA T776, LO T776, LY T776, LB T776 LHGB T686 LT T68C, LB T68C - Hyper Mini TOPLED® LB M676 - Mini TOPLED Santana® LG M470 LS M47K, LO M47K, LY M47K Source: http://www.osram.convergy.de LUXEON: - LUMILED® LXK2-PW12-R00, LXK2-PW12-S00, LXK2-PW14-U00, LXK2-PW14-V00 LXK2-PM12-R00, LXK2-PM12-S00, LXK2-PM14-U00 LXK2-PE12-Q00, LXK2-PE12-R00, LXK2-PE12-S00, LXK2-PE14-T00, LXK2-PE14-U00 LXK2-PB12-K00, LXK2-PB12-L00, LXK2-PB12-M00, LXK2-PB14-N00, LXK2-PB14-P00, LXK2-PB14-Q00 LXK2-PR12-L00, LXK2-PR12-M00, LXK2-PR14-Q00, LXK2-PR14-R00 LXK2-PD12-Q00, LXK2-PD12-R00, LXK2-PD12-S00 LXK2-PH12-R00, LXK2-PH12-S00 LXK2-PL12-P00, LXK2-PL12-Q00, LXK2-PL12-R00 Source: www.luxeon.com KINGBRIGHT: KA-3528ASYC Source: www.kingbright.com
Q1-Q32 = MMBT3904LT3G:MMBT3904LT3G: Transistor NPN 40V 200mA SOT-23 ON Semi MMBT3904LT3G NPN Bipolar Transistor, 900 mA 40 V, 3-Pin SOT-23 Source: Datasheet <http://www.onsemi.com/pub/Collateral/MMBT3904LT1-D.PDF>; DESCRIPTION: Transistor NPN 40V 200mA SOT-23 ON Semi MMBT3904LT3G NPN Bipolar Transistor, 900 mA 40 V, 3-Pin SOT-23; HEIGHT: 1.11mm; MANUFACTURER_NAME: onsemi; MANUFACTURER_PART_NUMBER: MMBT3904LT3G; MOUSER_PART_NUMBER: 863-MMBT3904LT3G; MOUSER_PRICE-STOCK: https://www.mouser.co.uk/ProductDetail/onsemi/MMBT3904LT3G?qs=HVbQlW5zcXUpjKhCMxE5QQ%3D%3D
R1-R66 = rcl:R-EU_: RESISTOR, European symbol; SPICEPREFIX: R
S1 = SparkFun-Switches:MOMENTARY-SWITCH-SPST: Momentary Switch (Pushbutton) - SPST Normally-open (NO) SPST momentary switches (buttons, pushbuttons). Variants PTH-12MM - 12mm square, through-hole Momentary Pushbutton Switch - 12mm Square <https://www.sparkfun.com/products/9190> (COM-09190) PTH-6.0MM, PTH-6.0MM-KIT - 6.0mm square, through-hole Mini Pushbutton Switch <https://www.sparkfun.com/products/97> (COM-00097) KIT package intended for soldering kit's - only one side of pads' copper is exposed. PTH-RIGHT-ANGLE-KIT - Right-angle, through-hole Right Angle Tactile Button <https://www.sparkfun.com/products/10791> - Used on SparkFun BigTime Watch Kit <https://www.sparkfun.com/products/11734> SMD-12MM - 12mm square, surface-mount Tactile Button - SMD (12mm) <https://www.sparkfun.com/products/12993> (COM-12993) Used on SparkFun PicoBoard <https://www.sparkfun.com/products/11888> SMD-4.5MM - 4.5mm Square Trackball Switch Used on SparkFun Blackberry Trackballer Breakout <https://www.sparkfun.com/products/13169> SMD-4.6MMX2.8MM - 4.60mm x 2.80mm, surface mount Used on SparkFun SAMD21 Mini Breakout <https://www.sparkfun.com/products/13664> SMD-5.2MM, SMD-5.2-REDUNDANT - 5.2mm square, surface-mount Mini Pushbutton Switch - SMD <https://www.sparkfun.com/products/8720> (COM-08720) Used on Arduino Pro Mini <https://www.sparkfun.com/products/11114> REDUNDANT package connects both switch circuits together SMD-6.0X3.5MM - 6.0 x 3.5mm, surface mount Momentary Reset Switch SMD <https://www.sparkfun.com/products/8229> (COM-08229) SMD-6.2MM-TALL - 6.2mm square, surface mount Tactile Button - SMD (6mm) <https://www.sparkfun.com/products/12992> Used on SparkFun Digital Sandbox <https://www.sparkfun.com/products/12651> SMD-RIGHT-ANGLE - Right-angle, surface mount Used on SparkFun Block for Intel® Edison - Arduino <https://www.sparkfun.com/products/13036>; PROD_ID: SWCH-14278; SF_SKU: COM-08229
U1COL1-8 U2COL9-16 U3COL17-24 U4COL25-32 U5ROW1-8 U6ROW9-16 U7ROW17-24 U8ROW25-32 = TC74HC595AF_EL_F_:TC74HC595AF(EL,F): Check availability <https://pricing.snapeda.com/parts/TC74HC595AF%28EL%2CF%29/Toshiba%20Semiconductor/view-part?ref=eda>; AVAILABILITY: In Stock; CHECK_PRICES: https://www.snapeda.com/parts/TC74HC595AF(EL,F)/Toshiba+Semiconductor+and+Storage/view-part/?ref=eda; DESCRIPTION: Shift Shift Register 1 Element 8 Bit 16-SOP; MF: Toshiba Semiconductor; MP: TC74HC595AF(EL,F); PACKAGE: SOP-16 Toshiba; PRICE: None; PURCHASE-URL: https://www.snapeda.com/api/url_track_click_mouser/?unipart_id=1140723&manufacturer=Toshiba Semiconductor&part_name=TC74HC595AF(EL,F)&search_term=None; SNAPEDA_LINK: https://www.snapeda.com/parts/TC74HC595AF(EL,F)/Toshiba+Semiconductor+and+Storage/view-part/?ref=snap
U$1 = angelo-ch340k-nopad:CH430K: CH340K usb - uart
U$2 = angelo-PY32F002BF15P6TU:PY32F030F18P6TU

## Net classes
0 default: width 0.152 mm, clearance 0.152 mm
1 supply: width 0.406 mm, clearance 0.152 mm to class 0, clearance 0.152 mm

## Board
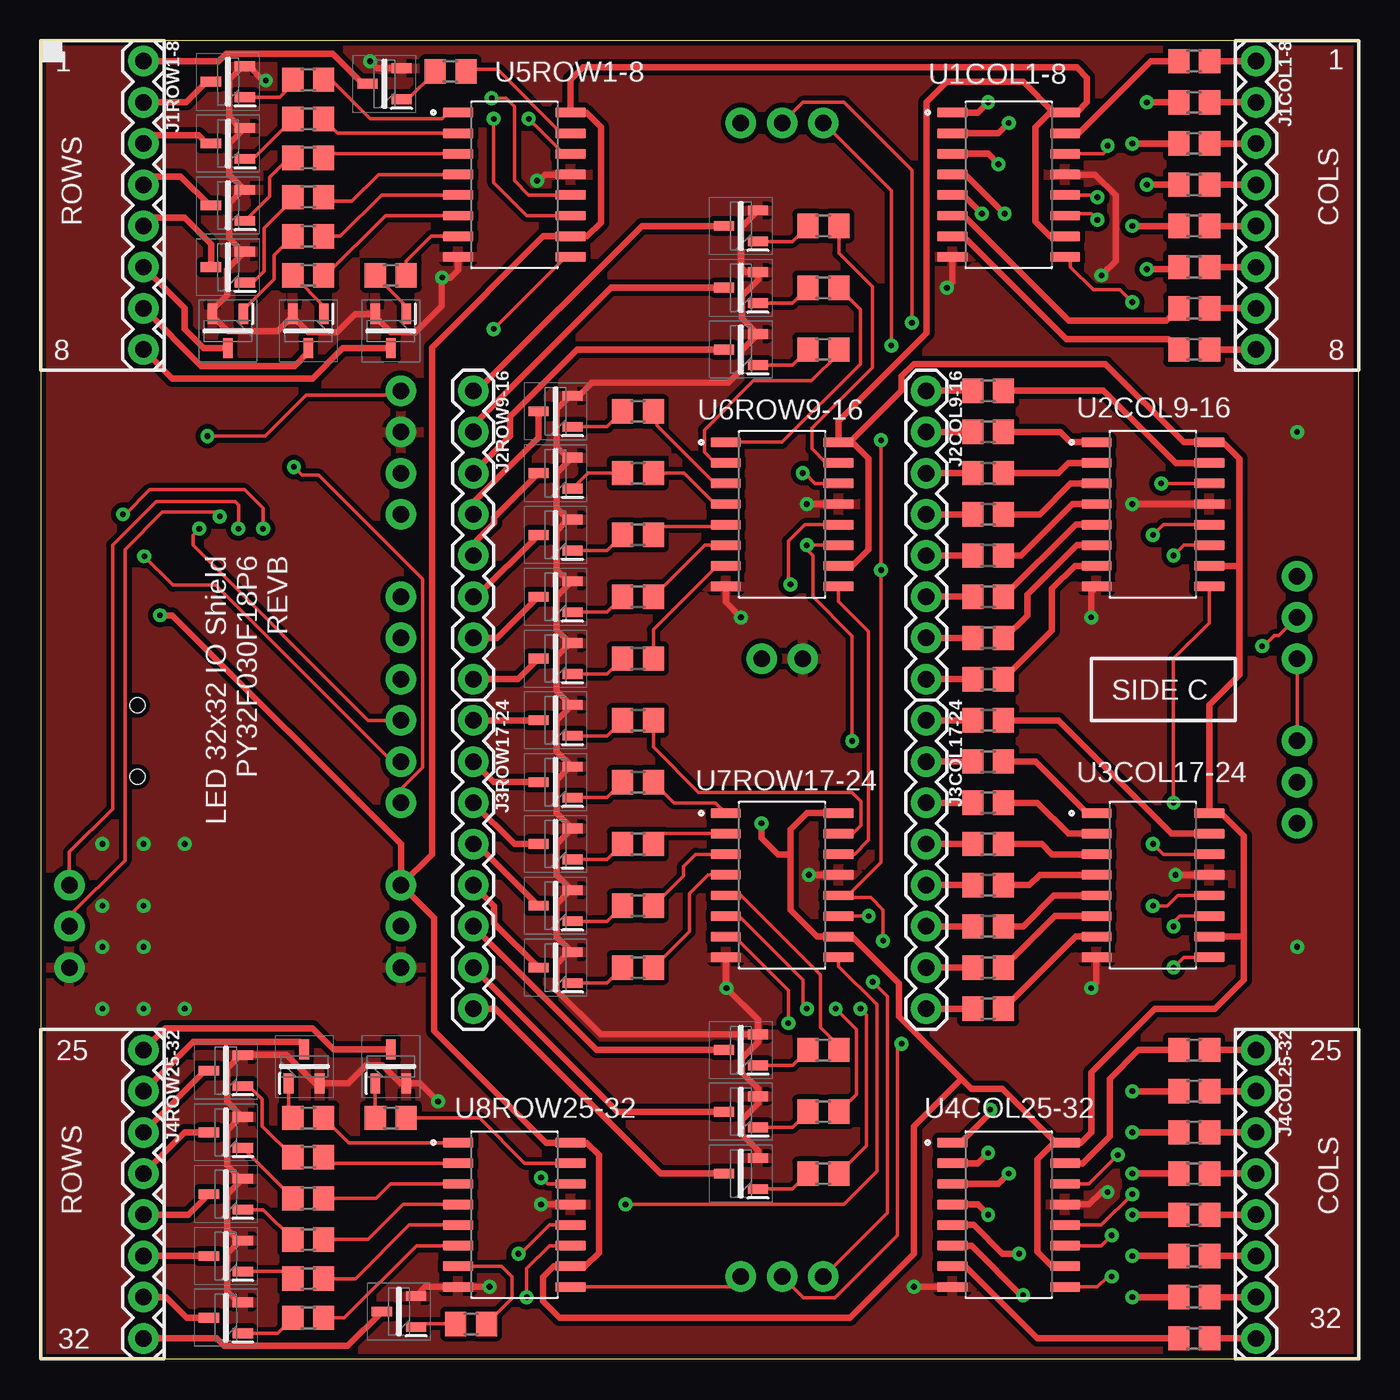
[diagram p6: board, top side]
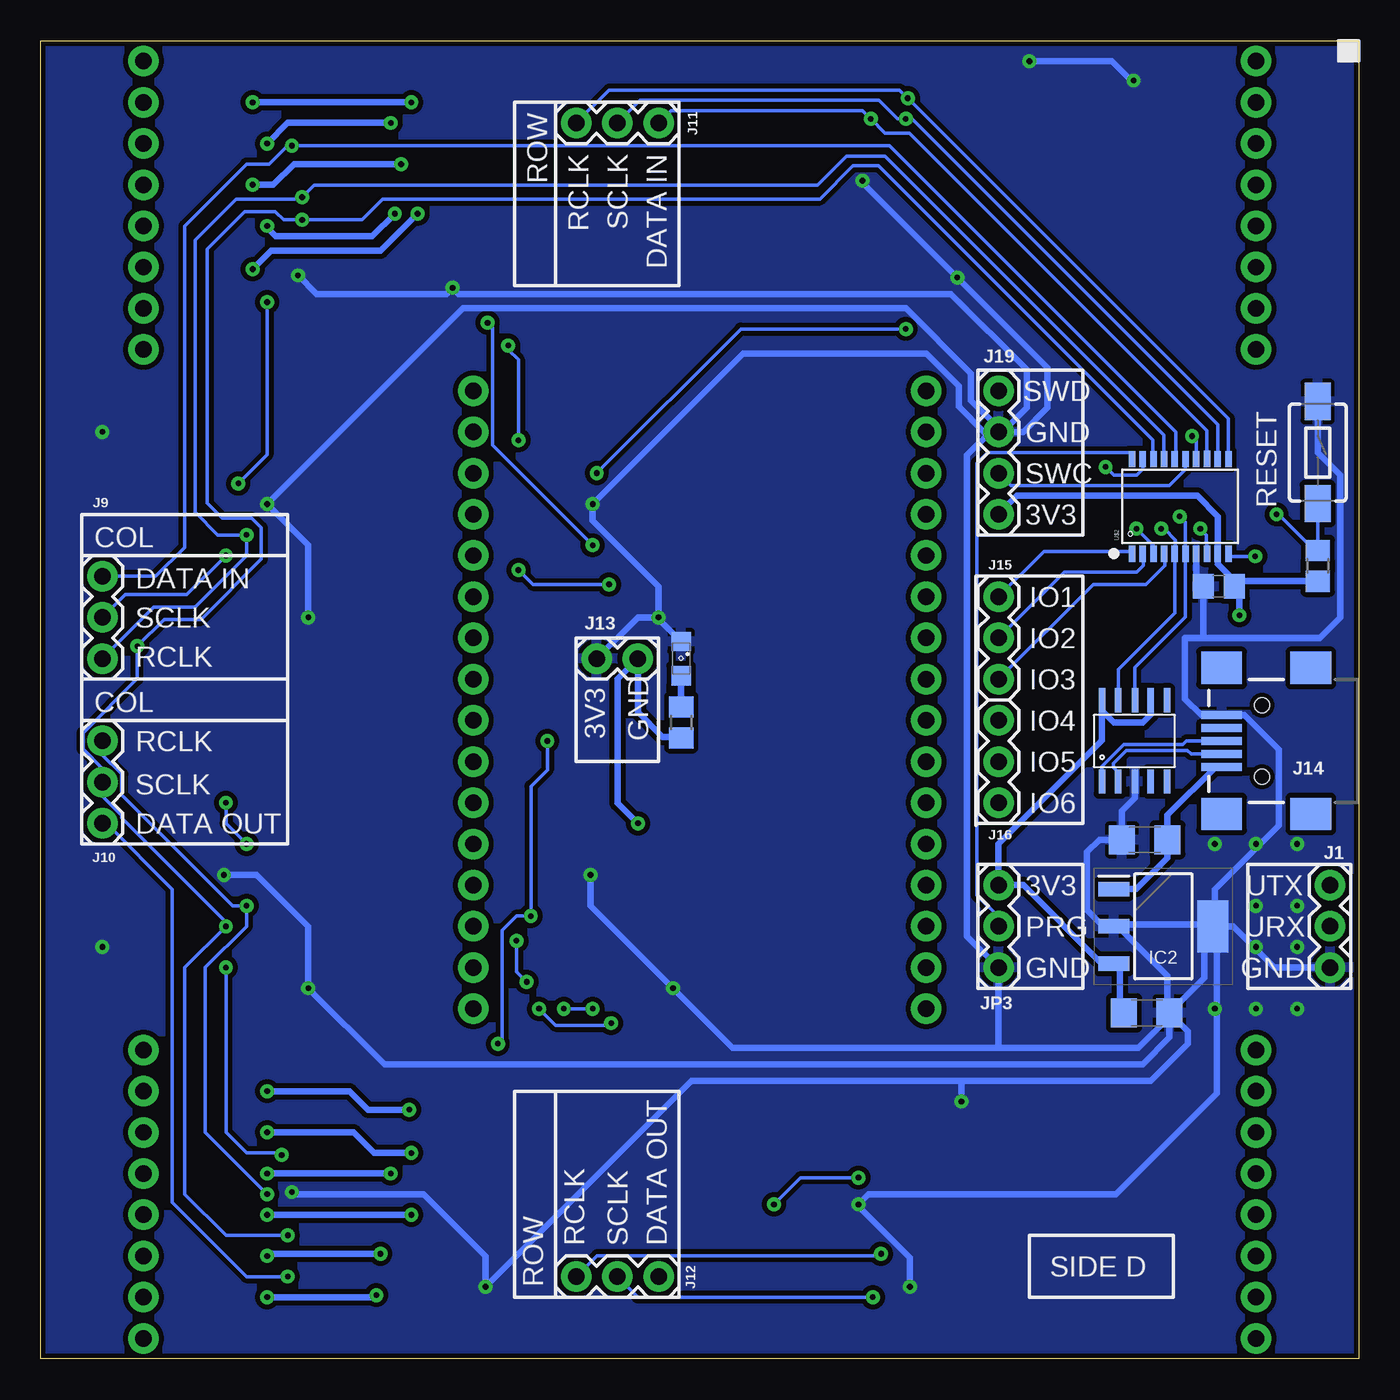
[diagram p7: board, bottom side, seen from below]

Size 81.28 x 81.28 mm. Coordinates in mm from the lower left corner, seen from the top.
Outline: 0,0 81.28,0 81.28,81.28 0,81.28 0,0
Copper layers (1*16): Top 0.035mm / dielectric 1.6mm / Bottom 0.035mm
Design rules "angelo-jlcpcb-2layers": minimum track width 8mil, minimum drill 0.3mm, track to track 6mil, track to pad 6mil, pad to pad 6mil, via to via 10mil, smd to smd 6mil, copper to edge 0.2mm, drill to drill 8mil, minimum pad ring 10mil, minimum via ring 10mil, stop-mask expansion 4mil, vias tented up to drill 0mil, thermal gap 10mil

### Footprints (pad centres in the part's own frame; a part is rotated, then mirrored left to right if it is on the bottom)
C0805 = smd 1.3 x 1.5: 1 -0.95,0; 2 0.95,0
C1206 = smd 1.6 x 1.8: 1 -1.4,0; 2 1.4,0
SOT230P700X180-4N = smd 1.9 x 0.9: 1 -3.05,2.3; 2 -3.05,0; 3 -3.05,-2.3 | smd 1.9 x 3.2: 4 3.05,0
1X03 = drill 1.016 pad 1.88: 1 0,0; 2 2.54,0; 3 5.08,0
1X08 = drill 1.016 pad 1.88: 1 0,0; 2 2.54,0; 3 5.08,0; 4 7.62,0; 5 10.16,0; 6 12.7,0; 7 15.24,0; 8 17.78,0
1X02 = drill 1.016 pad 1.88: 1 0,0; 2 2.54,0
USB-MINIB = smd 2.5 x 0.5: D+ 2.5,0; D- 2.5,0.8; GND 2.5,-1.6; ID 2.5,-0.8; VBUS 2.5,1.6 | smd 2.5 x 2: S1 -3,4.5; S2 2.5,4.5; S3 -3,-4.5; S4 2.5,-4.5 | hole 0.9: 0,2.2; 0,-2.2
1X04 = drill 1.016 pad 1.88: 1 0,0; 2 2.54,0; 3 5.08,0; 4 7.62,0
SML0805 = smd 1.2 x 1.2: A 1.05,0; C -1.05,0
SOT96P237X111-3N = smd 1.25 x 0.6: 1 -1.05,0.955; 2 -1.05,-0.955; 3 1.05,0
R0805 = smd 1.3 x 1.5: 1 -0.95,0; 2 0.95,0
TACTILE_SWITCH_SMD_6.0X3.5MM = smd 2.3 x 1.6: 1 -3.15,0; 2 3.15,0
SOIC127P780X190-16N = smd 1.87 x 0.61: 1 -3.475,4.445; 2 -3.475,3.175; 3 -3.475,1.905; 4 -3.475,0.635; 5 -3.475,-0.635; 6 -3.475,-1.905; 7 -3.475,-3.175; 8 -3.475,-4.445; 9 3.475,-4.445; 10 3.475,-3.175; 11 3.475,-1.905; 12 3.475,-0.635; 13 3.475,0.635; 14 3.475,1.905; 15 3.475,3.175; 16 3.475,4.445
ESSOP-10 = smd 1.5 x 0.4: P$1 -2.5,2; P$2 -2.5,1; P$3 -2.5,-0.032; P$4 -2.5,-1; P$5 -2.5,-2; P$6 2.5,-2; P$7 2.5,-1; P$8 2.5,-0.032; P$9 2.5,1; P$10 2.5,2
TSSOP20 = smd 1 x 0.4: 1 -2.937,2.693; 2 -2.937,2.032; 3 -2.937,1.372; 4 -2.937,0.712; 5 -2.937,0.051; 6 -2.937,-0.609; 7 -2.937,-1.27; 8 -2.943,-1.93; 9 -2.937,-2.59; 10 -2.937,-3.251; 11 2.905,-3.251; 12 2.905,-2.59; 13 2.911,-1.93; 14 2.905,-1.27; 15 2.905,-0.609; 16 2.905,0.051; 17 2.905,0.712; 18 2.905,1.372; 19 2.905,2.032; 20 2.905,2.693

### Placement (x,y rotation side)
C1  8.64,47.62 180 bottom
C9  13.08,21.34 0 bottom
C10  13.21,32 180 bottom
IC2  12.06,26.67 0 bottom
J1  1.78,24.13 90 bottom
J1COL1-8  74.93,80.01 270 top
J1ROW1-8  6.35,80.01 270 top
J2COL9-16  54.61,59.69 270 top
J2ROW9-16  26.67,59.69 270 top
J3COL17-24  54.61,39.37 270 top
J3ROW17-24  26.67,39.37 270 top
J4COL25-32  74.93,19.05 270 top
J4ROW25-32  6.35,19.05 270 top
J9  77.47,48.26 270 bottom
J10  77.47,33.02 90 bottom
J11  43.18,76.2 180 bottom
J12  43.18,5.08 180 bottom
J13  46.99,43.18 0 bottom
J14  5.97,38.1 180 bottom
J15  22.23,41.91 90 bottom
J16  22.23,34.29 90 bottom
J19  22.23,59.69 270 bottom
JP3  22.23,29.21 270 bottom
L2  41.78,43.18 270 bottom
Q1  21.21,78.61 180 top
Q2  11.56,78.74 180 top
Q3  11.56,74.93 180 top
Q4  11.56,71.12 180 top
Q5  11.56,67.31 180 top
Q6  11.56,63.37 270 top
Q7  16.51,63.37 270 top
Q8  21.59,63.37 270 top
Q9  43.18,69.85 180 top
Q10  43.18,66.04 180 top
Q11  43.18,62.23 180 top
Q12  31.75,58.42 180 top
Q13  31.75,54.61 180 top
Q14  31.75,50.8 180 top
Q15  31.75,46.99 180 top
Q16  31.75,43.18 180 top
Q17  31.75,39.37 180 top
Q18  31.75,35.56 180 top
Q19  31.75,31.75 180 top
Q20  31.75,27.94 180 top
Q21  31.75,24.13 180 top
Q22  43.18,19.05 180 top
Q23  43.18,15.24 180 top
Q24  43.18,11.43 180 top
Q25  21.59,18.03 90 top
Q26  16.26,18.03 90 top
Q27  11.43,17.78 180 top
Q28  11.43,13.97 180 top
Q29  11.43,10.16 180 top
Q30  11.43,6.35 180 top
Q31  11.43,2.54 180 top
Q32  22.1,2.92 180 top
R1  25.27,79.38 180 top
R2  16.51,78.87 180 top
R3  16.51,76.45 180 top
R4  16.51,74.04 180 top
R5  16.51,71.63 180 top
R6  16.51,69.22 180 top
R7  16.51,66.8 180 top
R8  21.59,66.8 180 top
R9  71.12,80.01 180 top
R10  71.12,77.47 180 top
R11  71.12,74.93 180 top
R12  71.12,72.39 180 top
R13  71.12,69.85 180 top
R14  71.12,67.31 180 top
R15  71.12,64.77 180 top
R16  71.12,62.23 180 top
R17  58.42,49.53 0 top
R18  58.42,46.99 0 top
R19  58.42,44.45 0 top
R20  58.42,41.91 0 top
R21  58.42,59.69 0 top
R22  58.42,57.15 0 top
R23  58.42,54.61 0 top
R24  58.42,52.07 0 top
R25  58.42,29.21 0 top
R26  58.42,26.67 0 top
R27  58.42,24.13 0 top
R28  58.42,21.59 0 top
R29  58.42,39.37 0 top
R30  58.42,36.83 0 top
R31  58.42,34.29 0 top
R32  58.42,31.75 0 top
R33  71.12,8.89 180 top
R34  71.12,6.35 180 top
R35  71.12,3.81 180 top
R36  71.12,1.27 180 top
R37  71.12,19.05 180 top
R38  71.12,16.51 180 top
R39  71.12,13.97 180 top
R40  71.12,11.43 180 top
R41  48.26,69.85 180 top
R42  48.26,66.04 180 top
R43  48.26,62.23 180 top
R44  36.83,58.42 180 top
R45  36.83,54.61 180 top
R46  36.83,50.8 180 top
R47  36.83,46.99 180 top
R48  36.83,43.18 180 top
R49  36.83,39.37 180 top
R50  36.83,35.56 180 top
R51  36.83,31.75 180 top
R52  36.83,27.94 180 top
R53  36.83,24.13 180 top
R54  48.26,19.05 180 top
R55  48.26,15.24 180 top
R56  48.26,11.43 180 top
R57  21.59,14.86 180 top
R58  16.51,14.86 180 top
R59  16.51,12.45 180 top
R60  16.51,9.91 180 top
R61  16.51,7.37 180 top
R62  16.51,4.95 180 top
R63  16.51,2.54 180 top
R64  26.54,2.16 180 top
R65  2.54,48.9 270 bottom
R66  41.78,39.24 270 bottom
S1  2.54,55.88 270 bottom
U1COL1-8  59.69,72.39 0 top
U2COL9-16  68.58,52.07 0 top
U3COL17-24  68.58,29.21 0 top
U4COL25-32  59.69,8.89 0 top
U5ROW1-8  29.21,72.39 0 top
U6ROW9-16  45.72,52.07 0 top
U7ROW17-24  45.72,29.21 0 top
U8ROW25-32  29.21,8.89 0 top
U$1  13.84,38.1 90 bottom
U$2  11.3,52.58 90 bottom

### Tracks (layer width: path | path; a pad name or v marks a point on that pad's centre or on a via)
+3V3  (via drill 0.35)
  Top 0.406: U1COL1-8.16 62.48,76.83 60.58,78.74 55.88,78.74 54.61,77.47 54.61,63.25 49.2,57.83 U6ROW9-16.16 49.91,56.52 | 62.55,13.4 62.61,13.34 U4COL25-32.16 64.14,13.34 64.77,13.97 64.77,17.65 68.71,21.59 72.39,21.59 74.17,23.37 74.17,26.04 | 62.55,13.4 59.31,16.64 57.39,16.64 56.76,17.26 | 74.17,26.04 74.17,32.26 72.77,33.66 U3COL17-24.16 72.06,40.3 73.91,42.16 73.91,48.9 | 73.91,48.9 73.91,55.5 72.9,56.52 U2COL9-16.16 70.48,56.52 65.66,61.34 53.85,61.34 53.09,60.58 53.09,59.69 49.91,56.52 | U1COL1-8.16 63.88,76.83 64.52,77.47 64.52,78.99 63.88,79.63 33.45,79.63 32.69,78.87 U5ROW1-8.16 33.66,76.83 34.54,75.95 34.54,70.06 33.7,69.22 U5ROW1-8.10 30.99,69.22 24.13,62.36 24.13,31.11 JP3.1 | 49.91,56.52 50.04,56.52 51.05,55.5 51.05,49.91 50.04,48.9 U6ROW9-16.10 | U3COL17-24.10 74.17,26.04 | 62.55,13.4 61.47,12.32 61.47,6.6 62.36,5.71 U4COL25-32.10 | U2COL9-16.10 73.91,48.9 | U1COL1-8.16 62.23,76.83 61.34,75.95 61.34,70.1 62.23,69.22 U1COL1-8.10 | 46.23,31.11 46.23,27.69 47.88,26.04 U7ROW17-24.10 50.04,26.04 52.91,23.16 52.91,21.12 56.76,17.26 | 46.23,31.11 46.23,32.64 47.24,33.66 U7ROW17-24.16 | JP3.1 22.23,31.75 8.13,45.85 v7.37,45.85 | 56.76,17.26 53.85,14.35 53.85,6.48 49.91,2.54 32,2.54 30.99,3.56 30.99,5.08 31.62,5.71 U8ROW25-32.10 33.57,5.71 34.42,6.56 34.42,12.57 33.66,13.34 U8ROW25-32.16 31.16,13.34 24.26,20.24 24.26,27.18 JP3.1 | v44.45,33.02 44.45,32.13 45.47,31.11 46.23,31.11
  Bottom 0.406: C1.1 7.69,47.98 8.71,49.01 U$2.9 8.69,49.66 8.69,51.93 9.97,53.21 21.08,53.21 J19.4 | C1.1 7.37,47.95 R65.2 | U$1.P$7 12.84,39.73 13.34,39.24 15.11,39.24 15.84,39.97 U$1.P$10 15.84,38.13 22.23,31.75 JP3.1 20.7,29.21 15.86,24.37 IC2.3 14.73,23.99 14.73,21.59 C9.1 | v7.37,45.85 7.37,47.3 C1.1 | v44.45,33.02 45.72,34.29 45.72,41.91 J13.2 44.45,39.88 42.93,38.35 41.84,38.35 R66.2
COL_DATA_IN  (via drill 0.35)
  Top 0.203: U1COL1-8.14 65.53,74.3 65.79,74.55 v65.79,74.8
  Bottom 0.203: U$2.16 11.3,55.53 11.3,57.15 28.96,74.8 v65.79,74.8 66.04,74.8 67.18,73.66 68.58,73.66 72.39,69.85 72.39,50.04 74.17,48.26 J9.1
COL_RCLK_IN  (via drill 0.35)
  Top 0.203: U4COL25-32.12 65.41,8.26 v67.31,10.16 | v68.58,27.94 69.47,27.94 70.1,28.57 U3COL17-24.12 | U2COL9-16.12 69.22,51.44 v68.58,50.8 | U1COL1-8.12 65.02,71.75 v65.15,71.63 | J10.3 J9.3
  Bottom 0.203: v67.31,10.16 71.12,13.97 71.12,24.13 68.58,26.67 v68.58,27.94 69.44,27.94 76.28,34.78 76.28,36.05 77.47,37.25 J10.3 | U$2.17 12.02,56.97 29.21,74.17 31.59,74.17 33.39,72.36 64.41,72.36 v65.15,71.63 65.28,71.5 69.22,71.5 71.75,68.96 71.75,52.2 70.36,50.8 v68.58,50.8 68.58,49.53 71.75,46.35 74.3,46.35 J9.3
COL_SLCK_IN  (via drill 0.35)
  Top 0.203: v69.85,26.67 69.85,26.92 70.23,27.3 U3COL17-24.11 | v66.04,7.62 65.41,6.99 U4COL25-32.11 | U2COL9-16.11 70.48,50.16 v69.85,49.53 | v65.15,70.23 64.77,70.61 63.29,70.61 U1COL1-8.11 | v75.31,43.94 75.4,43.94 76.05,44.6 76.35,44.6 J9.2
  Bottom 0.203: v66.04,7.62 69.85,7.62 72.39,10.16 72.39,24.13 v69.85,26.67 69.85,26.92 76.28,33.35 76.28,33.51 77.47,34.71 J10.2 77.47,36.41 78.66,37.61 78.66,38.59 75.31,41.95 v75.31,43.94 73.66,45.59 71.38,45.59 67.67,49.3 67.67,51.25 68.25,51.84 70.09,51.84 71.02,52.76 71.02,68.43 68.71,70.74 66.8,70.74 66.29,70.23 v65.15,70.23 61.47,70.23 60.2,71.5 33.24,71.5 31.19,73.56 29.61,73.56 12.7,56.64 12.7,55.51 U$2.18 | v69.85,49.53 72.26,47.12 76.07,47.12 J9.2
GND  (via drill 0.35)
  Top 0.406: Q31.2 12.19,3.5 11.5,4.19 11.5,6.48 12.33,7.3 Q30.2 12.19,7.3 11.5,8 11.5,10.16 12.45,11.12 Q29.2 12.32,11.12 11.5,11.93 11.5,14.1 12.33,14.93 Q28.2 12.44,14.93 11.5,15.87 11.5,17.91 12.33,18.73 Q27.2 15.18,18.73 16.93,16.98 Q26.2 18.95,16.98 20.06,18.09 21.08,18.09 22.19,16.98 Q25.2 23.4,16.98 v24.51,15.88 | Q22.2 44.23,19.52 43.25,18.54 43.25,17.65 44.23,16.67 Q23.2 44.23,15.71 43.25,14.73 43.25,13.84 44.23,12.86 Q24.2 | U4COL25-32.8 v53.85,4.45 | U4COL25-32.13 64.64,9.53 65.41,10.29 v65.79,10.29 | U8ROW25-32.13 v30.86,9.53 | v27.69,4.45 U8ROW25-32.8 23.72,4.45 Q32.2 | U7ROW17-24.8 42.24,22.91 v42.29,22.86 44.23,20.92 Q22.2 | U7ROW17-24.13 v47.37,29.84 | U5ROW1-8.8 25.73,67.14 25.27,66.67 v24.77,66.67 24.73,66.64 24.73,64.92 23.12,63.31 21.59,63.31 20.64,64.27 Q8.2 19.4,64.42 18.29,63.31 16.51,63.31 15.55,64.27 | U5ROW1-8.13 31.11,73.03 30.67,72.58 v30.61,72.64 | Q9.2 43.18,69.75 43.18,67.31 43.49,67 Q10.2 44.23,66.51 43.25,65.53 43.25,64.17 Q11.2 43.18,62.13 43.18,60.96 42.42,60.2 34,60.2 33.18,59.38 Q12.2 32.65,59.38 31.82,58.55 31.82,56.26 32.51,55.56 Q13.2 32.77,55.56 31.82,54.61 31.82,52.45 32.51,51.76 Q14.2 32.52,51.76 31.82,51.05 31.82,48.64 32.51,47.95 Q15.2 32.77,47.95 31.82,46.99 31.82,44.95 32.64,44.13 Q16.2 32.65,44.13 31.82,43.31 31.82,41.18 32.67,40.33 Q17.2 32.77,40.33 31.82,39.37 31.82,37.46 32.76,36.52 Q18.2 32.65,36.52 31.82,35.69 31.82,33.65 32.76,32.7 Q19.2 32.77,32.7 31.82,31.75 31.82,29.84 32.76,28.89 Q20.2 32.65,28.89 31.82,28.07 31.82,26.03 32.76,25.09 Q21.2 32.59,25.09 31.82,24.32 31.82,22.73 34.54,20 Q22.2
  Top 0.406: U6ROW9-16.8 42.24,46.66 v43.18,45.72 | U6ROW9-16.13 v47.24,52.7 | U2COL9-16.8 64.77,47.29 v64.77,45.72 | U2COL9-16.13 v67.31,52.7 | U1COL1-8.8 56.22,66.38 v55.88,66.04 | v65.41,66.8 66.29,67.69 66.29,71.74 65.01,73.03 U1COL1-8.13 | U3COL17-24.8 65.11,23.2 v64.77,22.86 | U3COL17-24.13 v69.98,29.84 | 15.55,64.27 15.53,64.3 14.61,63.37 11.53,63.37 10.6,64.3 Q6.2 10.6,64.68 11.5,65.57 11.5,67.18 12.48,68.16 12.63,68.16 12.61,68.19 Q5.2 12.44,68.27 11.63,69.08 11.63,71.25 12.45,72.08 Q4.2 12.57,72.08 11.63,73.02 11.63,74.93 12.58,75.89 Q3.2 12.32,75.89 11.63,76.58 11.63,78.87 12.45,79.69 Q2.2 12.86,79.69 13.74,78.82 v13.89,78.82 | Q7.2 15.55,64.27 | Q1.2 20.76,79.57 v20.32,80.01
  Bottom 0.406: v65.41,66.8 64.26,65.66 56.26,65.66 v55.88,66.04 55.5,65.66 25.15,65.66 20.48,60.99 20.48,58.64 21.97,57.15 J19.2 | v30.61,72.64 30.67,72.58 v24.77,66.67 19.21,61.12 19.21,58.64 20.7,57.15 J19.2 | v64.77,45.72 64.77,50.16 v67.31,52.7 55.24,64.77 27.94,64.77 23.91,60.74 23.91,59.09 22.23,57.4 J19.2 | v69.98,29.84 67.94,29.84 64.77,26.67 v64.77,22.86 60.07,18.16 13.34,18.16 11.68,19.82 C9.2 | v65.79,10.29 65.66,10.16 57.67,10.16 53.85,6.33 v53.85,4.45 41.15,17.14 24.51,17.14 | v47.37,29.84 47.37,27.94 v42.29,22.86 38.61,19.18 22.23,19.18 | v27.69,4.45 27.69,6.22 30.86,9.4 v30.86,9.53 30.23,10.16 14.99,10.16 8.76,16.38 8.76,26.42 IC2.4 | v43.18,45.72 43.18,47.62 47.24,51.69 v47.24,52.7 37.97,61.98 26.67,61.98 24.67,59.98 24.67,58.71 23.11,57.15 J19.2 | 9.59,44.45 C1.2 10.03,48.07 U$2.7 | IC2.2 14.86,26.67 11.81,23.62 11.81,21.46 C9.2 | J19.2 22.73,57.15 24.16,55.73 24.16,26.06 JP3.3 22.23,19.18 | v24.51,15.88 24.51,17.14 | v20.32,80.01 15.24,80.01 13.97,78.74 v13.89,78.82 | S1.1 2.54,55.88 1.14,54.48 1.14,45.72 2.41,44.45 9.59,44.45 | 9.59,44.45 10.73,44.45 10.73,40.7 9.73,39.7 J14.GND 7.07,39.7 4.95,37.58 4.95,32.89 8.89,28.96 8.89,26.67 IC2.4 | v43.18,45.72 44.45,45.72 J13.1 | L2.C 43.18,45.63 v43.18,45.72 | U$1.P$3 13.81,34.58 14.61,33.78 C10.2 16,32 16.76,31.24 16.76,27.69 15.75,26.67 IC2.2 | C9.2 11.68,21.08 13.59,19.18 22.23,19.18 | IC2.4 8.89,26.8 | 8.89,26.8 14.99,26.8 IC2.2 | C9.2 9.53,23.49 9.53,26.16 IC2.4 | C9.2 10.54,20.2 10.54,19.43 12.83,17.14 24.51,17.14 | IC2.4 7.75,26.67 5.21,24.13 J1.1
  other vias: 8.89,31.75 6.35,31.75 8.89,21.59 6.35,21.59 6.35,27.94 6.35,25.4 3.81,21.59 3.81,31.75 3.81,27.94 3.81,25.4 77.47,57.15 77.47,25.4
  pour Top (isolate 0.305): 0,0 0,81.28 81.28,81.28 81.28,0
  pour Bottom (isolate 0.305): 0,0 0,81.28 81.28,81.28 81.28,0
  pour Bottom (no thermals): 7.49,29.34 10.92,29.34 10.92,24.26 7.49,24.26
GPIO1
  Bottom 0.203: J15.3 19.43,49.78 14.14,49.78 U$2.1
GPIO2
  Bottom 0.203: U$2.2 13.29,49.59 13.29,48.91 13.68,48.51 18.16,48.51 J15.2
GPIO3
  Bottom 0.203: U$2.4 11.97,49.59 11.97,48.91 13.12,47.75 16.38,47.75 J15.1
GPIO4  (via drill 0.35)
  Top 0.203: v9.78,51.18 9.4,50.8 9.4,50.16 20.19,39.37 J16.3
  Bottom 0.203: v9.78,51.18 9.4,50.8 9.4,50.29 9.37,50.27 U$2.8
GPIO5  (via drill 0.35)
  Top 0.203: v6.4,49.48 8.18,47.7 10.79,47.7 21.67,36.83 J16.2
  Bottom 0.203: U$2.10 8.05,49.48 v6.4,49.48
GPIO6  (via drill 0.35)
  Top 0.203: J16.1 22.23,35.14 23.55,36.46 23.55,48.08 17.14,54.48 16.13,54.48 v15.62,54.99
  Bottom 0.203: v15.62,54.99 15.11,54.48 13.7,54.48 13.34,54.85 U$2.19
N$1
  Top 0.406: Q1.3 19.87,78.61 18,80.48 11.46,80.48 10.99,80.01 J1ROW1-8.1
N$2
  Top 0.406: Q2.3 10.25,78.74 8.98,77.47 J1ROW1-8.2
N$3
  Top 0.406: Q3.3 10.25,74.93 9.74,75.44 6.86,75.44 J1ROW1-8.3
N$4
  Top 0.406: Q4.3 10.41,71.12 8.64,72.9 6.86,72.9 J1ROW1-8.4
N$5
  Top 0.406: Q5.3 10.51,68.74 8.89,70.36 6.86,70.36 J1ROW1-8.5
N$6
  Top 0.406: Q6.3 11.43,62.32 11.02,62.32 10.07,62.32 8.89,63.5 8.89,64.77 J1ROW1-8.6
N$7
  Top 0.406: Q7.3 16.51,62.07 15.65,61.21 9.91,61.21 J1ROW1-8.7
N$8
  Top 0.406: Q8.3 18.64,62.32 16.76,60.45 8.13,60.45 J1ROW1-8.8
N$9  (via drill 0.35)
  Top 0.406: U1COL1-8.4 57.02,73.03 v59.44,70.61 | v67.31,69.85 R13.2
  Bottom 0.406: v59.44,70.61 60.83,69.22 66.79,69.22 67.31,69.74 v67.31,69.85
N$10
  Top 0.203: Q1.1 22.64,77.66 24.32,79.32 R1.2
N$11
  Top 0.203: Q2.1 14.73,77.78 15.56,78.61 R2.2
N$12
  Top 0.203: R3.2 13.08,73.97 Q3.1
N$13
  Top 0.203: R4.2 15.31,74.04 14.13,72.87 14.13,71.69 Q4.1
N$14
  Top 0.203: R5.2 15.56,71.5 13.78,69.72 13.78,67.06 13.08,66.36 Q5.1
N$15
  Top 0.203: Q6.1 12.51,64.68 14.4,66.57 14.4,68.04 15.56,69.2 R6.2
N$16
  Top 0.203: R7.2 17.52,64.84 Q7.1
N$17
  Top 0.203: R8.2 22.55,64.9 Q8.1
N$18  (via drill 0.35)
  Top 0.406: v59.05,73.66 58.42,74.3 U1COL1-8.3 | v68.2,72.39 R12.2
  Bottom 0.406: v59.05,73.66 65.66,73.66 66.93,72.39 v68.2,72.39
N$19  (via drill 0.35)
  Top 0.406: U1COL1-8.2 59.05,75.56 v59.69,76.2 | v67.31,74.93 R11.2
  Bottom 0.406: v59.69,76.2 66.04,76.2 v67.31,74.93
N$20  (via drill 0.35)
  Top 0.406: U1COL1-8.5 56.9,71.75 v58.04,70.61 | R14.2 70.04,67.18 v68.2,67.18
  Bottom 0.406: v58.04,70.61 60.33,68.33 67.06,68.33 v68.2,67.18
N$21
  Top 0.406: U1COL1-8.7 56.9,69.22 63.25,62.87 69.53,62.87 R16.2
N$22
  Top 0.406: U1COL1-8.6 56.91,70.48 63.39,64.01 69.41,64.01 R15.2
N$23  (via drill 0.35)
  Top 0.406: U1COL1-8.1 57.78,76.83 v58.42,77.47 | v68.2,77.47 R10.2
  Bottom 0.406: v58.42,77.47 v68.2,77.47
N$24
  Top 0.406: U1COL1-8.15 64.01,75.56 68.45,80.01 R9.2
N$25
  Top 0.406: J1COL1-8.3 R11.1
N$26
  Top 0.406: J1COL1-8.4 R12.1
N$27
  Top 0.406: R13.1 J1COL1-8.5
N$28
  Top 0.406: J1COL1-8.6 R14.1
N$29
  Top 0.406: J1COL1-8.7 R15.1
N$30
  Top 0.406: J1COL1-8.8 R16.1
N$33
  Bottom 0.406: L2.A R66.1
N$42
  Top 0.203: Q9.1 46.35,68.89 R41.2
N$43
  Top 0.406: R20.2 62.36,44.9 62.36,47.5 63.75,48.9 U2COL9-16.7
N$44
  Top 0.406: U2COL9-16.6 63.88,50.16 60.83,47.12 60.83,45.85 59.44,44.45 R19.2
N$45
  Top 0.406: J1COL1-8.2 R10.1
N$46
  Top 0.406: U2COL9-16.5 63.81,51.44 R18.2
N$47
  Top 0.406: U2COL9-16.4 63.63,52.7 60.45,49.53 R17.2
N$48
  Top 0.406: J1COL1-8.1 R9.1
N$49
  Top 0.406: R24.2 61.59,52.07 63.5,53.98 U2COL9-16.3
N$50
  Top 0.406: R23.2 62.74,54.61 63.37,55.24 U2COL9-16.2
N$51
  Top 0.406: R22.2 62.87,57.15 63.5,56.52 U2COL9-16.1
N$52
  Top 0.406: R21.2 65.53,59.69 69.98,55.24 U2COL9-16.15
N$53
  Top 0.406: J2COL9-16.2 R22.1
N$54
  Top 0.406: J2COL9-16.1 R21.1
N$55
  Top 0.406: J2COL9-16.3 R23.1
N$56
  Top 0.406: J2COL9-16.4 R24.1
N$57
  Top 0.203: Q10.1 46.35,65.08 R42.2
N$58
  Top 0.406: J2COL9-16.5 R17.1
N$59
  Top 0.406: J2COL9-16.6 R18.1
N$60
  Top 0.406: J2COL9-16.7 R19.1
N$61
  Top 0.406: J2COL9-16.8 R20.1
N$62  (via drill 0.35)
  Top 0.203: U2COL9-16.9 72.06,45.38 69.85,43.18 v69.85,34.29 | v68.58,31.75 69.22,31.11 U3COL17-24.14
  Bottom 0.203: v69.85,34.29 69.85,33.02 v68.58,31.75
N$63  (via drill 0.35)
  Top 0.203: U1COL1-8.9 63.5,67.61 63.5,67.31 64.9,65.91 66.55,65.91 v67.31,65.15 | v69.09,53.98 U2COL9-16.14
  Bottom 0.203: v67.31,65.15 67.31,55.75 v69.09,53.98
N$64
  Top 0.203: Q11.1 46.35,61.27 R43.2
N$65
  Top 0.203: Q12.1 34.92,57.47 R44.2
N$66
  Top 0.203: Q13.1 33.76,54.61 R45.2
N$67
  Top 0.406: R28.2 63.81,26.04 U3COL17-24.7
N$68
  Top 0.406: R27.2 62.55,27.3 U3COL17-24.6
N$69
  Top 0.406: R26.2 60.58,26.67 62.48,28.57 U3COL17-24.5
N$70
  Top 0.406: R25.2 60.96,29.21 61.59,29.84 U3COL17-24.4
N$71
  Top 0.406: R32.2 61.72,31.75 62.36,31.11 U3COL17-24.3
N$72
  Top 0.406: R31.2 61.47,34.29 63.37,32.38 U3COL17-24.2
N$73
  Top 0.406: R30.2 61.34,36.83 64.52,33.66 U3COL17-24.1
N$74
  Top 0.406: R29.2 62.74,39.37 69.72,32.38 U3COL17-24.15
N$75
  Top 0.406: J3COL17-24.2 R30.1
N$76
  Top 0.406: J3COL17-24.1 R29.1
N$77
  Top 0.406: J3COL17-24.3 R31.1
N$78
  Top 0.406: J3COL17-24.4 R32.1
N$79
  Top 0.406: J3COL17-24.5 R25.1
N$80
  Top 0.406: J3COL17-24.6 R26.1
N$81
  Top 0.406: J3COL17-24.7 R27.1
N$82
  Top 0.406: J3COL17-24.8 R28.1
N$83  (via drill 0.35)
  Top 0.203: U4COL25-32.14 64.64,10.79 v66.42,12.57 | v69.85,24.13 70.48,24.77 U3COL17-24.9
  Bottom 0.203: v66.42,12.57 66.55,12.7 68.58,12.7 69.85,13.97 v69.85,24.13
N$84
  Top 0.203: Q14.1 34.92,49.84 R46.2
N$85
  Top 0.203: Q15.1 34.92,46.03 R47.2
N$86
  Top 0.203: Q16.1 34.92,42.23 R48.2
N$88
  Top 0.406: U4COL25-32.7 57.02,5.71 61.47,1.27 R36.2
N$89  (via drill 0.35)
  Top 0.406: U4COL25-32.6 57.4,6.99 60.45,3.94 v60.58,3.94 | v67.31,3.81 R35.2
  Bottom 0.406: v60.58,3.94 60.71,3.81 v67.31,3.81
N$90  (via drill 0.35)
  Top 0.406: U4COL25-32.5 57.53,8.26 59.31,6.48 v60.33,6.48 | v67.31,6.35 R34.2
  Bottom 0.406: v60.33,6.48 67.18,6.48 v67.31,6.35
N$91  (via drill 0.35)
  Top 0.406: U4COL25-32.4 57.78,9.53 v58.42,8.89 | v67.31,8.89 R33.2
  Bottom 0.406: v58.42,8.89 v67.31,8.89
N$92  (via drill 0.35)
  Top 0.406: U4COL25-32.3 59.05,10.79 v59.69,11.43 | v67.31,11.43 R40.2
  Bottom 0.406: v59.69,11.43 v67.31,11.43
N$93  (via drill 0.35)
  Top 0.406: U4COL25-32.2 57.78,12.06 v58.42,12.7 | v67.31,13.97 R39.2
  Bottom 0.406: v58.42,12.7 60.71,12.7 61.98,13.97 v67.31,13.97
N$94  (via drill 0.35)
  Top 0.406: v58.55,15.37 58.55,15.16 56.72,13.34 U4COL25-32.1 | v67.31,16.51 R38.2
  Bottom 0.406: v58.55,15.37 61.09,15.37 62.23,16.51 v67.31,16.51
N$95
  Top 0.406: U4COL25-32.15 64.26,12.06 65.91,13.72 65.91,17.27 67.69,19.05 R37.2
N$96
  Top 0.406: J4COL25-32.2 R38.1
N$97
  Top 0.406: J4COL25-32.1 R37.1
N$98
  Top 0.406: J4COL25-32.3 R39.1
N$99
  Top 0.406: J4COL25-32.4 R40.1
N$100
  Top 0.406: J4COL25-32.5 R33.1
N$101
  Top 0.406: J4COL25-32.6 R34.1
N$102
  Top 0.406: J4COL25-32.7 R35.1
N$103
  Top 0.406: J4COL25-32.8 R36.1
N$104  (via drill 0.35)
  Top 0.203: U4COL25-32.9 65.15,4.45 65.79,5.08 v66.04,5.08
  Bottom 0.203: v66.04,5.08 68.58,5.08 73.15,9.65 73.15,28.96 77.22,33.02 J10.1
N$111
  Top 0.406: Q9.3 37.08,69.85 26.92,59.69 J2ROW9-16.1
N$112
  Top 0.406: Q10.3 35.18,66.04 26.67,57.53 J2ROW9-16.2
N$113
  Top 0.406: Q11.3 33.08,62.23 28.96,58.1 28.96,56.9 J2ROW9-16.3
N$114
  Top 0.406: Q12.3 30.7,56.81 26.95,53.06 26.67,52.78 J2ROW9-16.4
N$115
  Top 0.406: Q13.3 27.96,51.88 27.96,51.53 26.95,50.52 26.67,50.24 J2ROW9-16.5
N$116
  Top 0.406: Q14.3 26.89,46.99 J2ROW9-16.6
N$117
  Top 0.406: Q15.3 28.16,44.45 J2ROW9-16.7
N$118
  Top 0.406: Q16.3 29.43,41.91 J2ROW9-16.8
N$120
  Top 0.203: Q17.1 34.92,38.41 R49.2
N$121
  Top 0.203: Q18.1 34.92,34.6 R50.2
N$122
  Top 0.203: Q19.1 34.92,30.8 R51.2
N$123
  Top 0.203: Q20.1 34.92,26.98 R52.2
N$124
  Top 0.203: Q21.1 34.92,23.18 R53.2
N$125
  Top 0.203: Q22.1 46.35,18.09 R54.2
N$126
  Top 0.203: Q23.1 46.35,14.29 R55.2
N$127
  Top 0.203: Q24.1 46.35,10.47 R56.2
N$135
  Top 0.406: J3ROW17-24.1 Q17.3
N$136
  Top 0.406: Q18.3 27.94,35.56 J3ROW17-24.2
N$137
  Top 0.406: Q19.3 29.21,31.75 J3ROW17-24.3
N$138
  Top 0.406: Q20.3 26.89,31.75 J3ROW17-24.4
N$139
  Top 0.406: Q21.3 27.96,26.86 27.96,27.91 J3ROW17-24.5
N$140
  Top 0.406: Q22.3 34.29,19.05 J3ROW17-24.6
N$141
  Top 0.406: Q23.3 35.56,15.24 J3ROW17-24.7
N$142
  Top 0.406: Q24.3 38.23,11.43 28.07,21.59 J3ROW17-24.8
N$144
  Top 0.203: R57.2 Q25.1
N$145
  Top 0.203: R58.2 15.3,15.12 Q26.1
N$146
  Top 0.203: Q27.1 12.83,16.82 13.65,16 13.65,14.35 R59.2
N$147
  Top 0.203: Q28.1 12.48,12.99 R60.2
N$148
  Top 0.203: Q29.1 13.72,9.21 R61.2
N$149
  Top 0.203: Q30.1 15.12,5.39 R62.2
N$150
  Top 0.203: Q31.1 14.61,1.58 R63.2
N$151
  Top 0.203: R64.2 23.34,2.16 Q32.1
N$159
  Top 0.406: Q25.3 18.07,19.08 16.78,20.37 7.67,20.37 J4ROW25-32.1
N$160
  Top 0.406: Q26.3 16.26,19.3 16,19.56 9.4,19.56 J4ROW25-32.2
N$161
  Top 0.406: Q27.3 10.16,17.78 J4ROW25-32.3
N$162
  Top 0.406: Q28.3 8.89,13.97 J4ROW25-32.4
N$163
  Top 0.406: Q29.3 9.11,8.89 J4ROW25-32.5
N$164
  Top 0.406: J4ROW25-32.6 Q30.3
N$165
  Top 0.406: Q31.3 9.02,2.54 7.75,3.81 J4ROW25-32.7
N$166
  Top 0.406: Q32.3 18.93,0.8 11.33,0.8 10.86,1.27 J4ROW25-32.8
N$168
  Top 0.203: R8.1 22.54,67.69 24.06,69.22 U5ROW1-8.7
N$169
  Top 0.203: R7.1 17.59,66.8 21.27,70.48 U5ROW1-8.6
N$170
  Top 0.203: R6.1 18.48,69.22 21.02,71.75 U5ROW1-8.5
N$171
  Top 0.203: R5.1 17.71,71.37 19.18,71.37 20.83,73.03 U5ROW1-8.4
N$172
  Top 0.203: R4.1 17.71,74.3 U5ROW1-8.3
N$173
  Top 0.203: U5ROW1-8.2 18.33,75.56 17.46,76.43 R3.1
N$174
  Top 0.203: U5ROW1-8.1 25.15,76.83 24.77,76.45 20.32,76.45 17.91,78.87 R2.1
N$175
  Top 0.203: U5ROW1-8.15 32.1,75.56 28.16,79.5 26.35,79.5 R1.1
N$179
  Top 0.203: U6ROW9-16.7 41.71,48.9 37.78,44.97 R48.1
N$180
  Top 0.203: R47.1 40.95,50.16 U6ROW9-16.6
N$181
  Top 0.203: R46.1 38.29,51.31 42.12,51.31 U6ROW9-16.5
N$182
  Top 0.203: U6ROW9-16.4 41.58,52.7 39.67,54.61 R45.1
N$183
  Top 0.203: R44.1 37.78,58.17 38.01,57.94 38.01,57.55 41.58,53.98 U6ROW9-16.3
N$184
  Top 0.203: R43.1 49.21,61.98 47.53,60.3 43.97,60.3 40.93,57.26 40.93,55.9 41.58,55.24 U6ROW9-16.2
N$185
  Top 0.203: U6ROW9-16.1 45.72,56.52 50.55,61.34 50.55,64.7 R42.1
N$186
  Top 0.203: R41.1 49.21,68.18 51.28,66.11 51.28,61.11 47.54,57.37 47.54,56.13 48.43,55.24 U6ROW9-16.15
N$187
  Top 0.203: U6ROW9-16.9 49.2,46.69 51.05,44.83 51.05,32 50.16,31.11 U7ROW17-24.14
N$188  (via drill 0.35)
  Top 0.203: U6ROW9-16.14 47.75,53.98 47.12,54.61 v46.99,54.61 | v27.94,63.5 32.38,67.94 U5ROW1-8.9
  Bottom 0.203: v46.99,54.61 38.1,63.5 v27.94,63.5
N$189  (via drill 0.35)
  Top 0.203: U7ROW17-24.7 42.78,26.04 46.1,22.72 v46.1,20.7 | v50.55,21.59 50.93,21.21 50.93,13.15 R56.1
  Bottom 0.203: v46.1,20.7 46.23,20.57 49.53,20.57 v50.55,21.59
N$190  (via drill 0.35)
  Top 0.203: U7ROW17-24.6 43.05,27.3 46.99,23.37 46.99,21.84 v47.24,21.59 | v49.02,21.59 50.29,20.32 50.29,16.32 R55.1
  Bottom 0.203: v49.02,21.59 v47.24,21.59
N$191
  Top 0.203: R54.1 49.21,19.3 48.07,20.45 48.07,23.69 43.18,28.57 U7ROW17-24.5
N$192
  Top 0.203: R53.1 40.01,26.36 40.01,28.7 41.15,29.84 U7ROW17-24.4
N$193
  Top 0.203: R52.1 39.62,29.78 39.62,30.35 40.39,31.11 U7ROW17-24.3
N$194
  Top 0.203: R51.1 38.41,32.38 U7ROW17-24.2
N$195
  Top 0.203: R50.1 39.05,34.29 41.61,34.29 U7ROW17-24.1
N$196
  Top 0.203: R49.1 37.78,37.72 40.57,34.92 50.04,34.92 50.59,34.37 50.59,32.89 50.08,32.38 U7ROW17-24.15
N$197  (via drill 0.35)
  Top 0.203: U7ROW17-24.9 49.2,24.21 51.56,21.84 51.56,11.56 49.53,9.53 v36.07,9.53 | v30.86,11.18 31.24,10.79 U8ROW25-32.14
  Bottom 0.203: v36.07,9.53 34.42,11.18 v30.86,11.18
N$198
  Top 0.203: U8ROW25-32.7 28.43,5.71 29.06,5.08 29.06,3.73 R64.1
N$199
  Top 0.203: U8ROW25-32.6 23.18,6.99 18.73,2.54 R63.1
N$200
  Top 0.203: R62.1 19.43,4.95 22.73,8.26 U8ROW25-32.5
N$201
  Top 0.203: U8ROW25-32.4 22.35,9.53 20.19,7.37 R61.1
N$202
  Top 0.203: U8ROW25-32.3 21.59,10.79 20.7,9.91 R60.1
N$203
  Top 0.203: U8ROW25-32.2 17.84,12.06 R59.1
N$204
  Top 0.203: U8ROW25-32.1 18.98,13.34 R58.1
N$205
  Top 0.203: R57.1 27.05,14.86 29.84,12.06 U8ROW25-32.15
N$206
  Top 0.203: J12.1 42.55,4.45 U8ROW25-32.9
PA2-U1TX  (via drill 0.35)
  Top 0.203: v12.19,51.18 12.21,51.2 12.21,52.65 12.01,52.85 7.13,52.85 4.45,50.16 4.45,33.91 1.78,31.24 J1.3
  Bottom 0.203: U$1.P$9 14.84,42.51 11.35,45.99 U$2.5 11.31,49.69 11.31,50.5 11.99,51.18 v12.19,51.18
PA3-U1RX  (via drill 0.35)
  Top 0.203: v11.05,51.94 10.79,52.2 7.49,52.2 5.21,49.91 5.21,30.73 1.78,27.3 J1.2
  Bottom 0.203: U$1.P$8 13.81,42.63 10.69,45.75 U$2.6 10.69,51.59 v11.05,51.94
PA13-SWDIO  (via drill 0.35)
  Top 0.203: v10.29,56.9 13.84,56.9 16.38,59.44 21.97,59.44 J19.1
  Bottom 0.203: v10.29,56.9 10.03,56.64 U$2.14 | U$2.14
PA14-SWCLK
  Bottom 0.203: U$2.15 10.69,54.83 11.68,53.85 21.46,53.85 J19.3
PF2-NRST  (via drill 0.35)
  Top 0.203: v13.72,51.18 13.72,52.45 12.57,53.59 6.73,53.59 5.21,52.07 v5.08,52.07
  Bottom 0.203: S1.2 R65.1 2.73,49.84 4.95,52.07 v5.08,52.07 | U$2.3 12.68,50.14 v13.72,51.18
PF4-BOOT0
  Bottom 0.203: U$2.20 14,55.86 14.01,55.88 22.9,55.88 23.55,55.23 23.55,28.59 22.23,27.27 JP3.2
ROW_DATA_IN  (via drill 0.35)
  Top 0.203: U5ROW1-8.14 32.26,74.3 v30.1,76.45
  Bottom 0.203: U$2.13 9.37,57.22 27.72,75.56 29.21,75.56 v30.1,76.45 30.61,76.96 42.42,76.96 J11.1
ROW_RCLK_IN  (via drill 0.35)
  Top 0.203: U8ROW25-32.12 31.37,8.26 29.59,6.48 v29.46,6.48 | U5ROW1-8.12 30.1,71.75 29.21,72.64 29.21,77.22 28.7,77.72 v27.81,77.72 | U6ROW9-16.12 47.12,51.44 46.1,50.42 46.1,47.88 v46.23,47.75 | v51.94,25.78 51.94,27.69 51.18,28.45 49.32,28.45 U7ROW17-24.12 49.78,28.57 51.82,30.61 v51.82,48.64 v51.82,56.64 | v51.31,23.24 52.2,22.35 52.2,9.02 J12.3 | v52.45,62.48 52.45,72.01 J11.3
  Bottom 0.203: v29.46,6.48 29.57,6.37 46.97,6.37 J12.3 | v51.82,48.64 50.93,47.75 v46.23,47.75 | v51.94,25.78 51.94,23.88 v51.31,23.24 | v52.45,62.48 52.45,62.23 51.82,61.59 v51.82,56.64 | U$2.11 8.05,57.96 v27.81,77.72 28.32,78.23 46.23,78.23 J11.3
ROW_SCLK_IN  (via drill 0.35)
  Top 0.203: U8ROW25-32.11 31.37,6.99 29.97,5.59 v29.97,3.81 | U5ROW1-8.11 29.97,70.48 27.94,72.52 v27.94,76.45 | v53.09,19.43 52.83,19.18 52.83,7.62 48.97,3.76 47.04,3.76 J12.2 | v51.05,27.3 U7ROW17-24.11 | v50.04,38.1 50.04,44.58 47.62,46.99 47.62,49.52 47.24,49.9 v47.24,50.16 U6ROW9-16.11 | v53.72,63.88 53.72,73.28 49.53,77.47 46.99,77.47 J11.2
  Bottom 0.203: v53.09,19.43 52.83,19.68 52.83,26.42 51.94,27.3 v51.05,27.3 51.05,35.31 50.04,36.32 v50.04,38.1 | v53.72,63.88 53.42,63.58 53.42,56.34 v47.24,50.16 | U$2.12 8.71,57.61 27.56,76.45 v27.94,76.45 28.45,76.45 29.59,77.6 44.32,77.6 J11.2 | J12.2 44.45,3.81 v29.97,3.81
USB_N
  Bottom 0.203: U$1.P$2 14.84,36.15 15.15,36.46 15.15,36.72 14.35,37.52 10.57,37.52 10.35,37.3 J14.D-
USB_P
  Bottom 0.203: U$1.P$1 15.84,36.53 14.5,37.88 10.86,37.88 10.64,38.1 J14.D+
VBUS
  Bottom 0.406: J14.VBUS 8.84,36.5 11.81,33.53 C10.1 11.81,30.88 13.72,28.97 IC2.1

### Text on the board
tNames: 1 | 1 | ROWS | COLS | 8 | 8 | LED 32x32 IO Shield / PY32F030F18P6 / REVB | SIDE C | 25 | 25 | ROWS | COLS | 32 | 32
bNames: ROW | DATA IN | SCLK | RCLK | SWD | RESET | GND | SWC | 3V3 | COL | DATA IN | IO1 | SCLK | IO2 | RCLK | IO3 | COL | IO4 | GND | 3V3 | RCLK | IO5 | SCLK | IO6 | DATA OUT | UTX | 3V3 | URX | PRG | GND | GND | DATA OUT | SCLK | RCLK | SIDE D | ROW